# EAGLE design EMC02-Chopped (EAGLE 7.4.0)

## Sheet 1 of 4: MCU
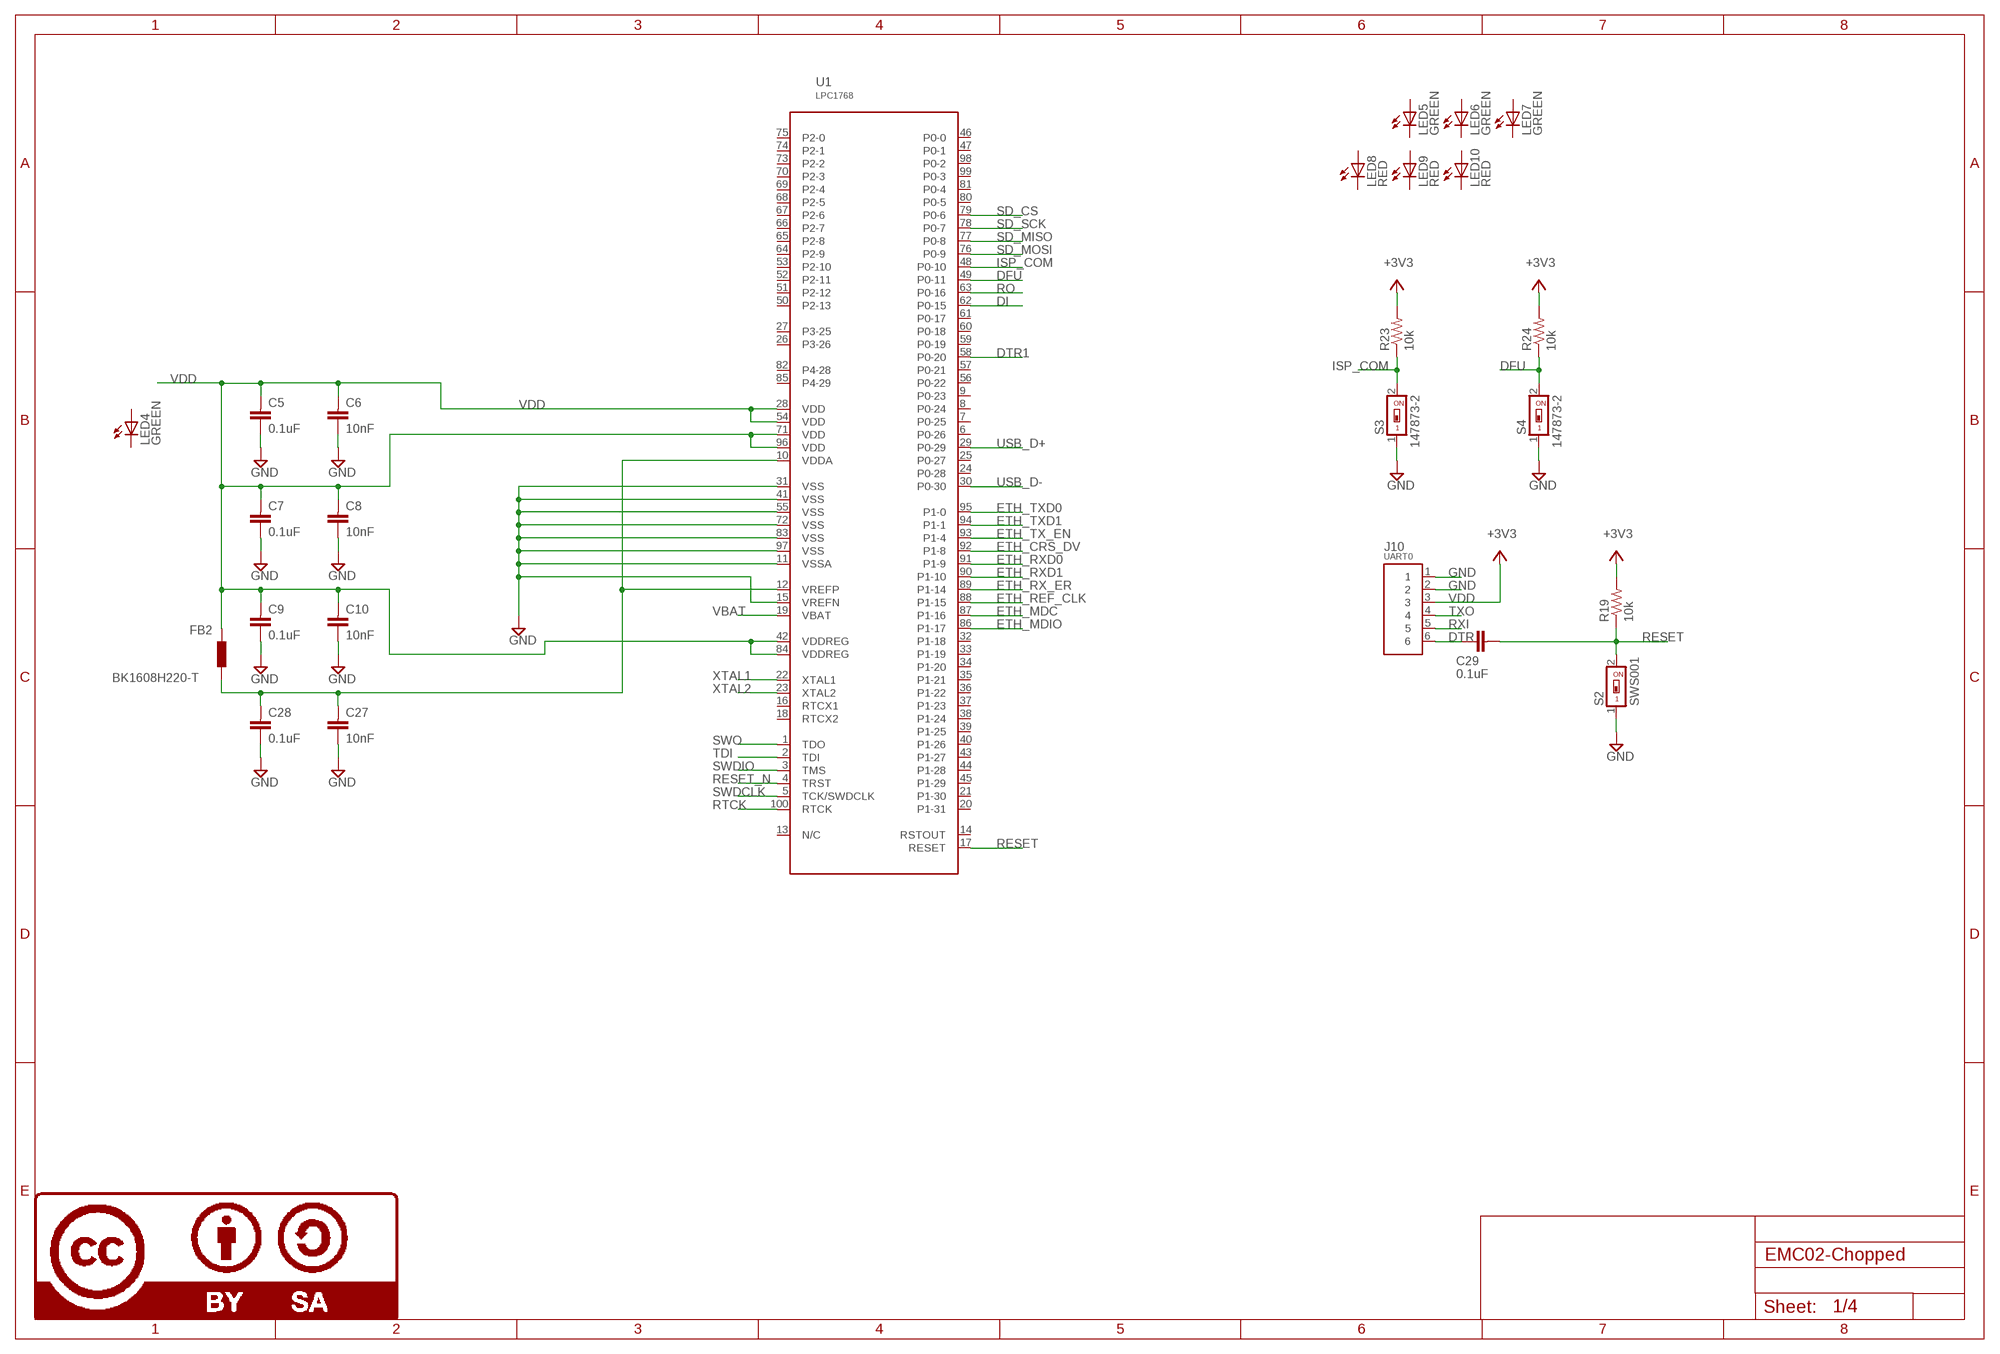
[diagram p0: schematic, sheet 1]

### Parts
C5  0.1uF  CPL-CAP-X5R-0603-0.1UF-35V  [C0603]
C6  10nF  CPL-CAP-X7R-10NF-16V  [C0603]
C7  0.1uF  CPL-CAP-X5R-0603-0.1UF-35V  [C0603]
C8  10nF  CPL-CAP-X7R-10NF-16V  [C0603]
C9  0.1uF  CPL-CAP-X5R-0603-0.1UF-35V  [C0603]
C10  10nF  CPL-CAP-X7R-10NF-16V  [C0603]
C27  10nF  CPL-CAP-X7R-10NF-16V  [C0603]
C28  0.1uF  CPL-CAP-X5R-0603-0.1UF-35V  [C0603]
C29  0.1uF  CPL-CAP-X7R-0603-0.1UF-35V  [C0603]
FB2  BK1608H220-T  BLM15HBK1608H220-T0603  [F0603]
J10  UART0  CPL-CON-HEADER-0.1IN-6P-M  [CON-HDR-6POS-MALE]
LED4  GREEN  CPL-LED-0603-GREEN  [LED0603]
LED5  GREEN  CPL-LED-0603-GREEN  [LED0603]
LED6  GREEN  CPL-LED-0603-GREEN  [LED0603]
LED7  GREEN  CPL-LED-0603-GREEN  [LED0603]
LED8  RED  CPL-LED-0603-RED  [LED0603]
LED9  RED  CPL-LED-0603-RED  [LED0603]
LED10  RED  CPL-LED-0603-RED  [LED0603]
LOGO8  LOGO-CC-BY-SALARGE  [LOGO-CC-BY-SA]
R19  10k  CPL-RES-0603-10K-0.1W  [R0603]
R23  10k  CPL-RES-0603-10K-0.1W  [R0603]
R24  10k  CPL-RES-0603-10K-0.1W  [R0603]
S2  SWS001  [SMS-001]
S3  147873-2  CPL-SW-MOM-0603  [0603]
S4  147873-2  CPL-SW-MOM-0603  [0603]
U1  LPC1768  LPC1768LQFP-100  [LQFP-100]

### Nets
+3V3: J10.3 R19.2 R23.2 R24.2 ; also sheet 2
DFU: R24.1 S4.2 U1.49(P0-11)
DI: U1.62(P0-15) ; also sheet 2
DTR: C29.1 J10.6
DTR1: U1.58(P0-20) ; also sheet 2
ETH_CRS_DV: U1.92(P1-8) ; also sheet 2
ETH_MDC: U1.87(P1-16) ; also sheet 2
ETH_MDIO: U1.86(P1-17) ; also sheet 2
ETH_REF_CLK: U1.88(P1-15) ; also sheet 2
ETH_RX_ER: U1.89(P1-14) ; also sheet 2
ETH_RXD0: U1.91(P1-9) ; also sheet 2
ETH_RXD1: U1.90(P1-10) ; also sheet 2
ETH_TX_EN: U1.93(P1-4) ; also sheet 2
ETH_TXD0: U1.95(P1-0) ; also sheet 2
ETH_TXD1: U1.94(P1-1) ; also sheet 2
GND [power]: C5.1 C6.1 C7.1 C8.1 C9.1 C10.1 C28.1 J10.1 J10.2 S2.1 S3.1 S4.1 U1.11(VSSA) U1.15(VREFN) U1.31(VSS) U1.41(VSS) U1.55(VSS) U1.72(VSS) U1.83(VSS) U1.97(VSS) ; also sheet 2,3,4
GND1: C27.1
ISP_COM: R23.1 S3.2 U1.48(P0-10)
N$2: C27.2 C28.2 FB2.1 U1.10(VDDA) U1.12(VREFP)
RESET: C29.2 R19.1 S2.2 U1.17(RESET)
RESET_N: U1.4(TRST) ; also sheet 2
RO: U1.63(P0-16) ; also sheet 2
RTCK: U1.100(RTCK) ; also sheet 2
RXI: J10.5
SD_CS: U1.79(P0-6) ; also sheet 2
SD_MISO: U1.77(P0-8) ; also sheet 2
SD_MOSI: U1.76(P0-9) ; also sheet 2
SD_SCK: U1.78(P0-7) ; also sheet 2
SWDCLK: U1.5(TCK/SWDCLK) ; also sheet 2
SWDIO: U1.3(TMS) ; also sheet 2
SWO: U1.1(TDO) ; also sheet 2
TDI: U1.2(TDI) ; also sheet 2
TXO: J10.4
USB_D+: U1.29(P0-29) ; also sheet 2
USB_D-: U1.30(P0-30) ; also sheet 2
VBAT: U1.19(VBAT)
VDD: C5.2 C6.2 C7.2 C8.2 C9.2 C10.2 FB2.2 U1.28(VDD) U1.42(VDDREG) U1.54(VDD) U1.71(VDD) U1.84(VDDREG) U1.96(VDD)
XTAL1: U1.22(XTAL1) ; also sheet 2
XTAL2: U1.23(XTAL2) ; also sheet 2
Unconnected: LED4.A LED4.C LED5.A LED5.C LED6.A LED6.C LED7.A LED7.C LED8.A LED8.C LED9.A LED9.C LED10.A LED10.C U1.6(P0-26) U1.7(P0-25) U1.8(P0-24) U1.9(P0-23) U1.13(N/C) U1.14(RSTOUT) U1.16(RTCX1) U1.18(RTCX2) U1.20(P1-31) U1.21(P1-30) U1.24(P0-28) U1.25(P0-27) U1.26(P3-26) U1.27(P3-25) U1.32(P1-18) U1.33(P1-19) U1.34(P1-20) U1.35(P1-21) U1.36(P1-22) U1.37(P1-23) U1.38(P1-24) U1.39(P1-25) U1.40(P1-26) U1.43(P1-27) U1.44(P1-28) U1.45(P1-29) U1.46(P0-0) U1.47(P0-1) U1.50(P2-13) U1.51(P2-12) U1.52(P2-11) U1.53(P2-10) U1.56(P0-22) U1.57(P0-21) U1.59(P0-19) U1.60(P0-18) U1.61(P0-17) U1.64(P2-9) U1.65(P2-8) U1.66(P2-7) U1.67(P2-6) U1.68(P2-5) U1.69(P2-4) U1.70(P2-3) U1.73(P2-2) U1.74(P2-1) U1.75(P2-0) U1.80(P0-5) U1.81(P0-4) U1.82(P4-28) U1.85(P4-29) U1.98(P0-2) U1.99(P0-3)

### Notes on the sheet
- VDD

## Sheet 2 of 4: Peripherals
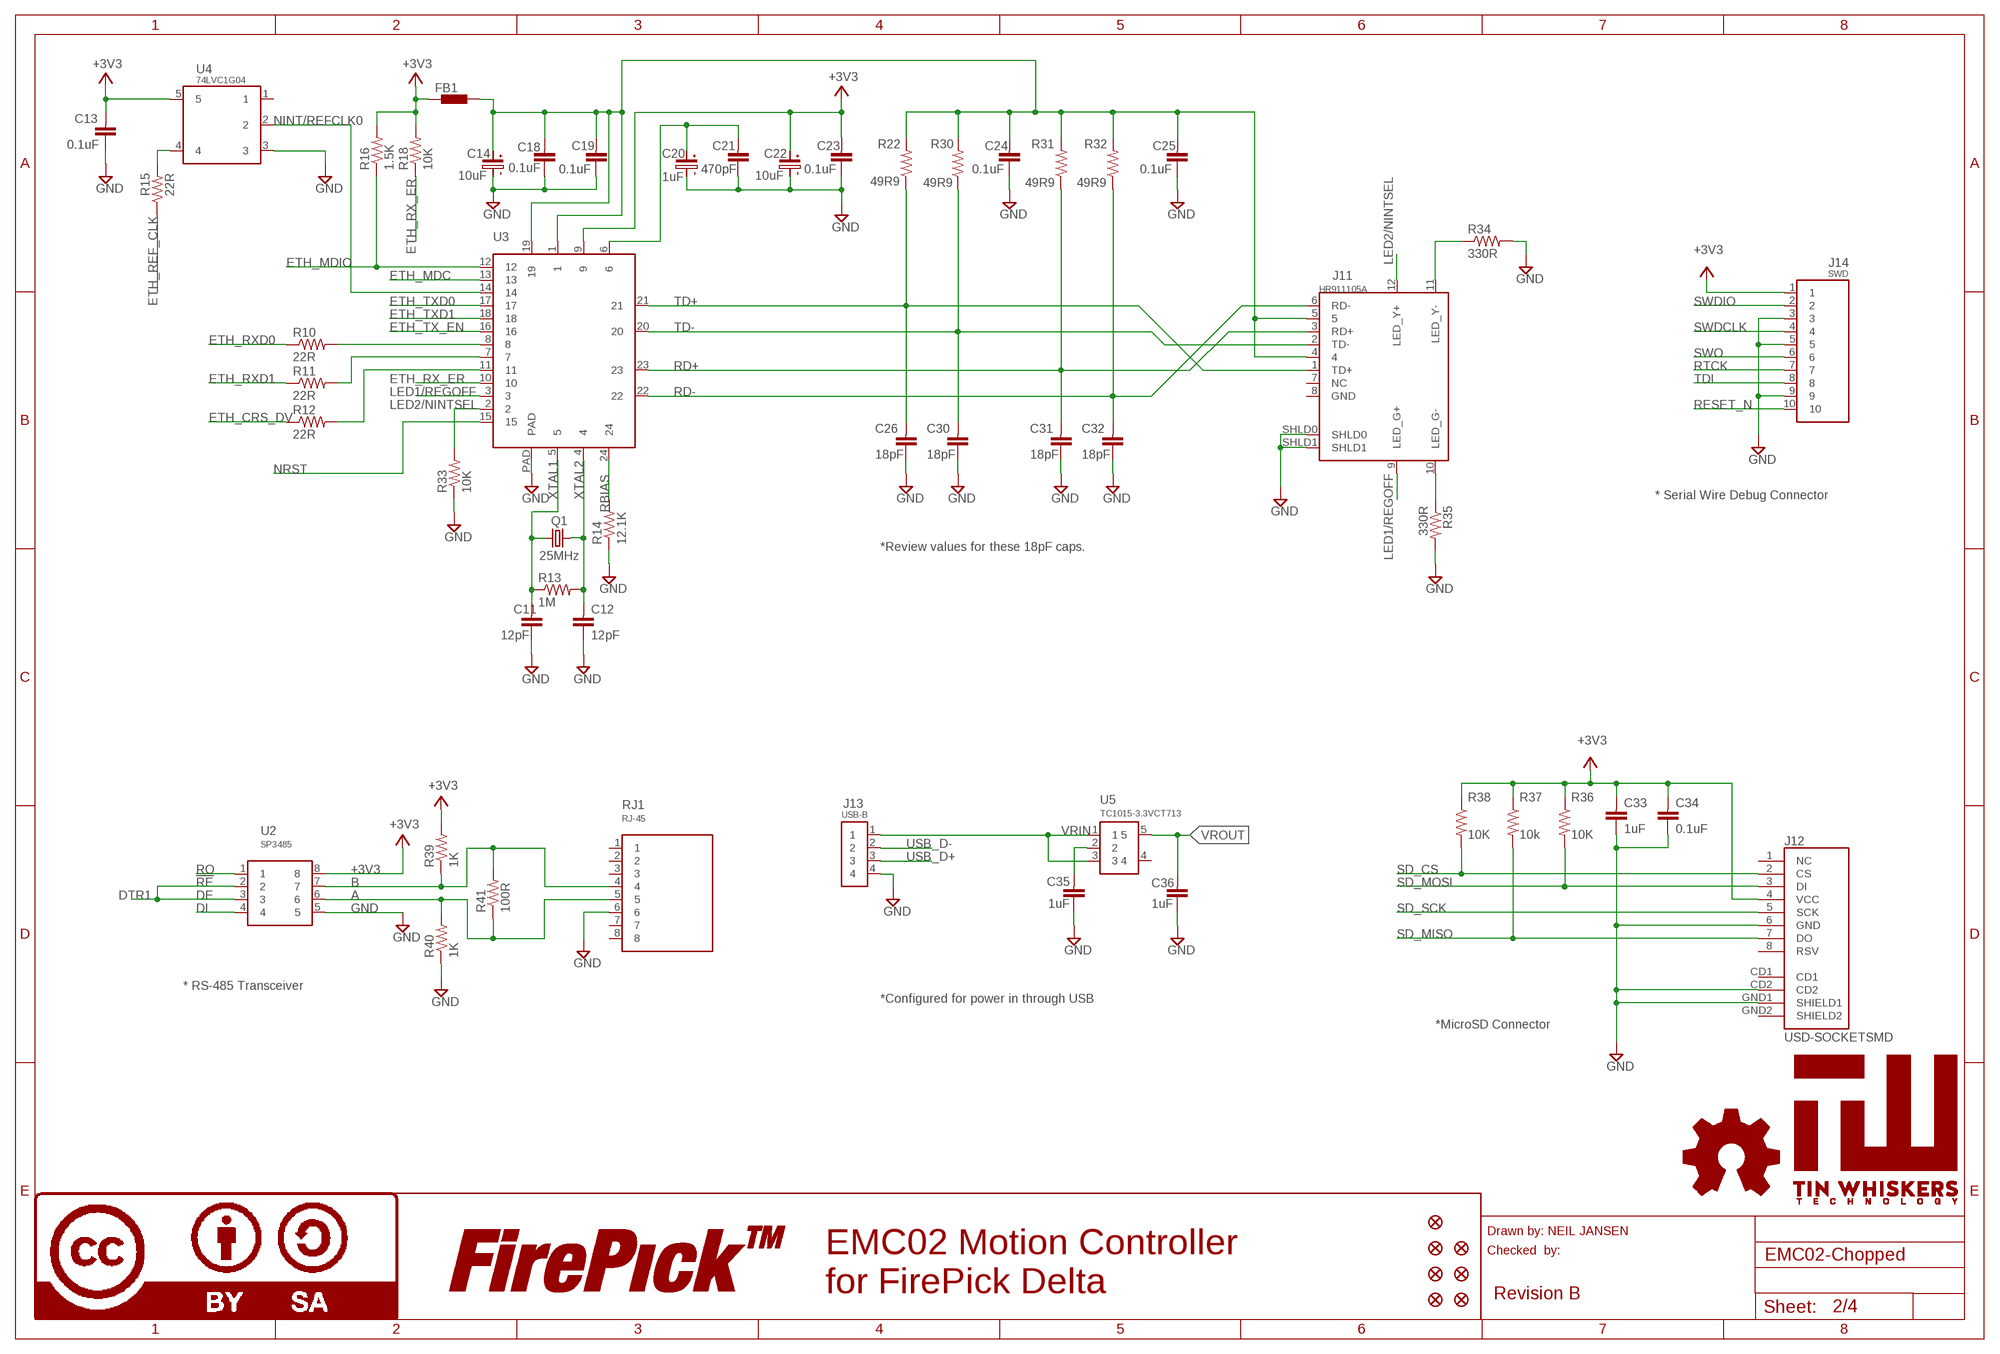
[diagram p1: schematic, sheet 2]

### Parts
C11  12pF  CPL-CAP-C0G-0603-12PF-50V  [C0603]
C12  12pF  CPL-CAP-C0G-0603-12PF-50V  [C0603]
C13  0.1uF  CPL-CAP-X5R-0603-0.1UF-35V  [C0603]
C14  10uF  CPL-CAP-ALU-RAD-10UF-50V  [C-RAD-6.3MM]
C18  0.1uF  CPL-CAP-X7R-0603-0.1UF-35V  [C0603]
C19  0.1uF  CPL-CAP-X7R-0603-0.1UF-35V  [C0603]
C20  1uF  CPL-CAP-ALU-SMD-1UF-50V  [C-SMD-4MM]
C21  470pF  CPL-CAP-X7R-0603-470PF-100V  [C0603]
C22  10uF  CPL-CAP-ALU-RAD-10UF-50V  [C-RAD-6.3MM]
C23  0.1uF  CPL-CAP-X7R-0603-0.1UF-35V  [C0603]
C24  0.1uF  CPL-CAP-X7R-0603-0.1UF-35V  [C0603]
C25  0.1uF  CPL-CAP-X7R-0603-0.1UF-35V  [C0603]
C26  18pF  CPL-CAP-C0G-0603-18PF-50V  [C0603]
C30  18pF  CPL-CAP-C0G-0603-18PF-50V  [C0603]
C31  18pF  CPL-CAP-C0G-0603-18PF-50V  [C0603]
C32  18pF  CPL-CAP-C0G-0603-18PF-50V  [C0603]
C33  1uF  CPL-CAP-X5R-0603-1UF-50V  [C0603]
C34  0.1uF  CPL-CAP-X5R-0603-0.1UF-35V  [C0603]
C35  1uF  CPL-CAP-X5R-0603-1UF-50V  [C0603]
C36  1uF  CPL-CAP-X5R-0603-1UF-50V  [C0603]
FB1  BLM15HBK1608H220-T0603  [F0603]
FID1  FIDUCIAL  [FIDUCIAL]
FID2  FIDUCIAL  [FIDUCIAL]
FID3  FIDUCIAL  [FIDUCIAL]
FID4  FIDUCIAL  [FIDUCIAL]
FID5  FIDUCIAL  [FIDUCIAL]
FID6  FIDUCIAL  [FIDUCIAL]
FID7  FIDUCIAL  [FIDUCIAL]
J11  HR911105A  CPL-ETH-MACJACK-LED-SHLD  [MAGJACK(HR911105A)]
J12  USD-SOCKETSMD  [MICRO-SD-SOCKET-PP]
J13  USB-B  CPL-CON-USB-B  [USB-B(THRU)]
J14  SWD  CPL-CON-HEADER-0.05IN-10P-M  [FTSH-105-01-XXX-DV-K]
LOGO4  LOGO-FIREPICKLARGE  [LOGO-FIREPICK]
LOGO5  LOGO-OSHWMEDIUM  [LOGO-OSHW-MEDIUM]
LOGO6  LOGO-CC-BY-SALARGE  [LOGO-CC-BY-SA]
Q1  25MHz  CPL-OSC-CRY-25MHZ-18PF  [HC-49/U-S]
R10  22R  CPL-RES-0603-22R-0.1W  [R0603]
R11  22R  CPL-RES-0603-22R-0.1W  [R0603]
R12  22R  CPL-RES-0603-22R-0.1W  [R0603]
R13  1M  CPL-RES-0603-1M-0.1W  [R0603]
R14  12.1K  CPL-RES-0603-12.1K-0.1W  [R0603]
R15  22R  CPL-RES-0603-22R-0.1W  [R0603]
R16  1.5K  CPL-RES-0603-1.5K-50V  [R0603]
R18  10K  CPL-RES-0603-10K-0.1W  [R0603]
R22  49R9  CPL-RES-0603-49.9-0.1W  [R0603]
R30  49R9  CPL-RES-0603-49.9-0.1W  [R0603]
R31  49R9  CPL-RES-0603-49.9-0.1W  [R0603]
R32  49R9  CPL-RES-0603-49.9-0.1W  [R0603]
R33  10K  CPL-RES-0603-10K-0.1W  [R0603]
R34  330R  CPL-RES-0603-330-0.1W  [R0603]
R35  330R  CPL-RES-0603-330-0.1W  [R0603]
R36  10K  CPL-RES-0603-10K-0.1W  [R0603]
R37  10k  CPL-RES-0603-10K-0.1W  [R0603]
R38  10K  CPL-RES-0603-10K-0.1W  [R0603]
R39  1K  CPL-RES-0603-1K-0.1W  [R0603]
R40  1K  CPL-RES-0603-1K-0.1W  [R0603]
R41  100R  CPL-RES-0603-100-0.1W  [R0603]
RJ1  RJ-45  CPL-CON-MOD-RJ45  [CON-RJ45]
U2  SP3485  [SOICN-8]
U3  CPL-ETH-PHY-LAN8720A  [QFN-24]
U4  74LVC1G04  CPL-INV-SOT25-5.5V-3.3V  [SOT-25]
U5  TC1015-3.3VCT713  CPL-REG-LIN-3.3V-0.1A  [SOT-23-5]
U$25  TIN-WHISKERSTSTOP  [TIN-WHISKERS-TSTOP]

### Nets
+3V3: C13.2 C22.POS C23.2 C33.2 C34.2 FB1.1 J12.4(VCC) J14.1 R16.2 R18.2 R36.1 R37.1 R38.1 R39.2 U2.8 U3.9 U4.5 ; also sheet 1
A: R40.2 R41.1 RJ1.5 U2.6
B: R39.1 R41.2 RJ1.4 U2.7
DI: U2.4 ; also sheet 1
DTR1: U2.2 U2.3 ; also sheet 1
ETH_CRS_DV: R12.1 ; also sheet 1
ETH_MDC: U3.13 ; also sheet 1
ETH_MDIO: R16.1 U3.12 ; also sheet 1
ETH_REF_CLK: R15.1 ; also sheet 1
ETH_RX_ER: R18.1 U3.10 ; also sheet 1
ETH_RXD0: R10.1 ; also sheet 1
ETH_RXD1: R11.1 ; also sheet 1
ETH_TX_EN: U3.16 ; also sheet 1
ETH_TXD0: U3.17 ; also sheet 1
ETH_TXD1: U3.18 ; also sheet 1
GND [power]: C11.1 C12.1 C13.1 C14.NEG C18.1 C19.1 C20.NEG C21.1 C22.NEG C23.1 C24.1 C25.1 C26.1 C30.1 C31.1 C32.1 C33.1 C34.1 C35.1 C36.1 J11.SHLD0 J11.SHLD1 J12.6(GND) J12.CD2 J12.GND1(SHIELD1) J13.4 J14.3 J14.5 J14.9 R14.1 R33.1 R34.2 R35.2 R40.1 RJ1.6 U2.5 U3.PAD U4.3 ; also sheet 1,3,4
LED1/REGOFF: J11.9(LED_G+) U3.3
LED2/NINTSEL: J11.12(LED_Y+) R33.2 U3.2
N$1: R10.2 U3.8
N$3: R15.2 U4.4
N$6: C14.POS C18.2 C19.2 C24.2 C25.2 FB1.2 J11.4 J11.5 R22.2 R30.2 R31.2 R32.2 U3.1 U3.19
N$7: J11.11(LED_Y-) R34.1
N$8: J11.10(LED_G-) R35.1
N$17: C35.2 U5.2
N$18: R11.2 U3.7
N$19: R12.2 U3.11
N$23: C20.POS C21.2 U3.6
NINT/REFCLK0: U3.14 U4.2
NRST: U3.15
RBIAS: R14.2 U3.24
RD+: C31.2 J11.3(RD+) R31.1 U3.23
RD-: C32.2 J11.6(RD-) R32.1 U3.22
RESET_N: J14.10 ; also sheet 1
RO: U2.1 ; also sheet 1
RTCK: J14.7 ; also sheet 1
SD_CS: J12.2(CS) R38.2 ; also sheet 1
SD_MISO: J12.7(DO) R37.2 ; also sheet 1
SD_MOSI: J12.3(DI) R36.2 ; also sheet 1
SD_SCK: J12.5(SCK) ; also sheet 1
SWDCLK: J14.4 ; also sheet 1
SWDIO: J14.2 ; also sheet 1
SWO: J14.6 ; also sheet 1
TD+: C26.2 J11.1(TD+) R22.1 U3.21
TD-: C30.2 J11.2(TD-) R30.1 U3.20
TDI: J14.8 ; also sheet 1
USB_D+: J13.3 ; also sheet 1
USB_D-: J13.2 ; also sheet 1
VRIN: J13.1 U5.1 U5.3
VROUT: C36.2 U5.5
XTAL1: C11.2 Q1.1 R13.1 U3.5 ; also sheet 1
XTAL2: C12.2 Q1.2 R13.2 U3.4 ; also sheet 1
Unconnected: J11.7(NC) J11.8(GND) J12.1(NC) J12.8(RSV) J12.CD1 J12.GND2(SHIELD2) RJ1.1 RJ1.2 RJ1.3 RJ1.7 RJ1.8 U4.1 U5.4

### Notes on the sheet
- * Serial Wire Debug Connector
- *Review values for these 18pF caps.
- !RE
- DE
- * RS-485 Transceiver
- *Configured for power in through USB
- *MicroSD Connector
- Drawn by: NEIL JANSEN
- Checked  by:
- EMC02 Motion Controller
  for FirePick Delta
- Revision B

## Sheet 3 of 4
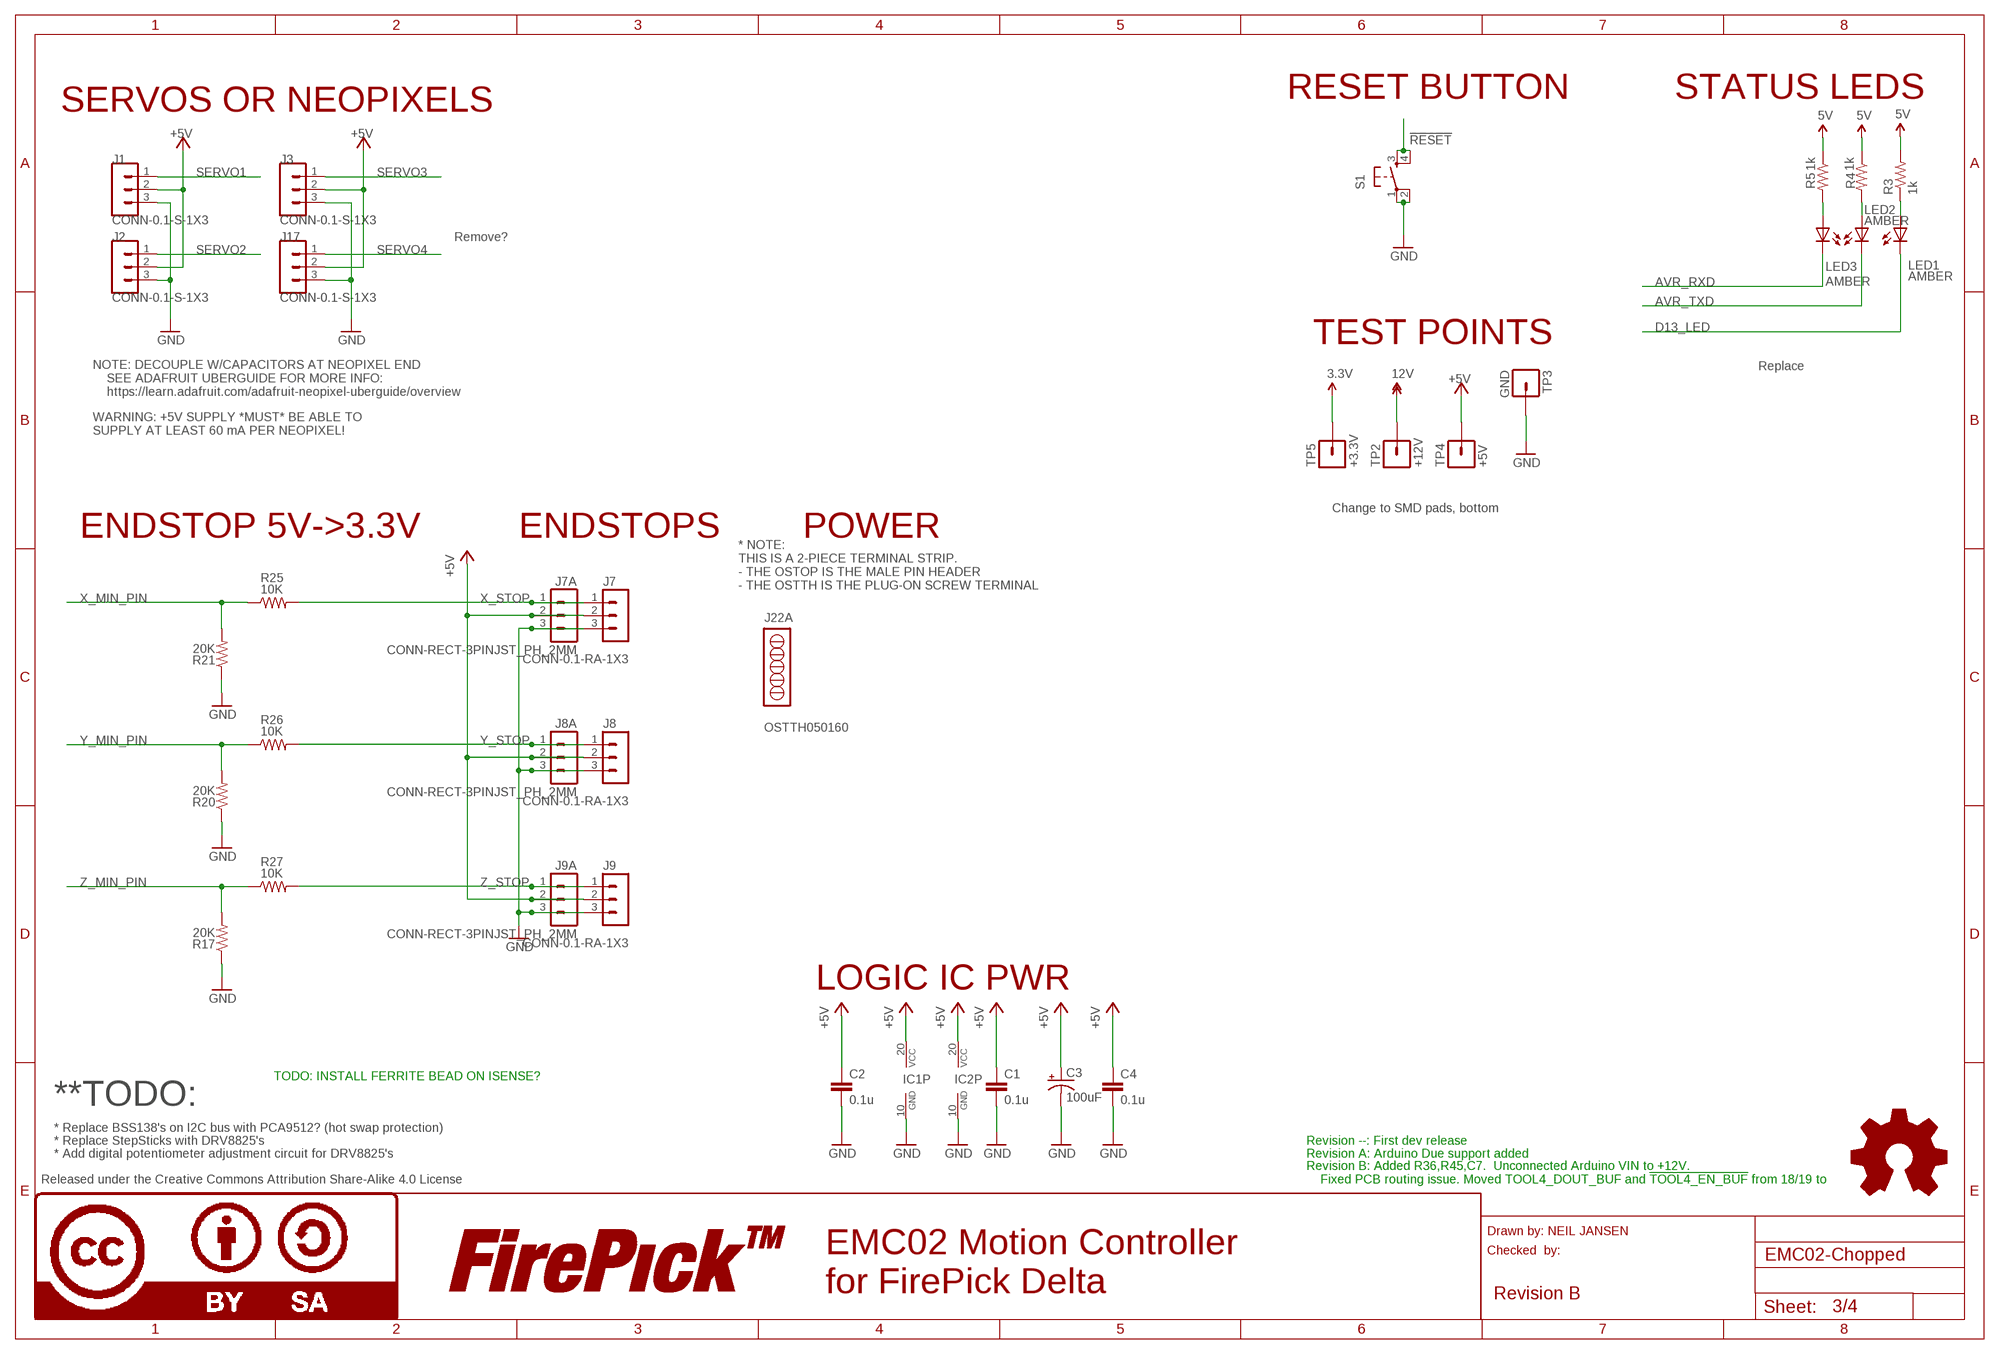
[diagram p2: schematic, sheet 3]

### Parts
C1  0.1u  CAP0805  [0805]
C2  0.1u  CAP0805  [0805]
C3  100uF  CPOL-USD  [PANASONIC_D]
C4  0.1u  CAP0805  [0805]
IC1  74ACT244DW  [SO20W]
IC2  74ACT244DW  [SO20W]
J1  CONN-0.1-S-1X3  MA03-1  [MA03-1]
J2  CONN-0.1-S-1X3  MA03-1  [MA03-1]
J3  CONN-0.1-S-1X3  MA03-1  [MA03-1]
J7  CONN-0.1-RA-1X3  MA03-1  [MA03-1]
J7A  CONN-RECT-3PINJST_PH_2MM  [CONN-JST_PH-2.0MM-3PIN-SMT-RA]
J8  CONN-0.1-RA-1X3  MA03-1  [MA03-1]
J8A  CONN-RECT-3PINJST_PH_2MM  [CONN-JST_PH-2.0MM-3PIN-SMT-RA]
J9  CONN-0.1-RA-1X3  MA03-1  [MA03-1]
J9A  CONN-RECT-3PINJST_PH_2MM  [CONN-JST_PH-2.0MM-3PIN-SMT-RA]
J17  CONN-0.1-S-1X3  MA03-1  [MA03-1]
J22A  OSTTH050160  CONN-OSTTH050160  [CONN-OSTTH050160]
LED1  AMBER  LED1206-NS  [LED-1206-NO_SILK]
LED2  AMBER  LED1206-NS  [LED-1206-NO_SILK]
LED3  AMBER  LED1206-NS  [LED-1206-NO_SILK]
LOGO1  LOGO-FIREPICKLARGE  [LOGO-FIREPICK]
LOGO2  LOGO-OSHWMEDIUM  [LOGO-OSHW-MEDIUM]
LOGO3  LOGO-CC-BY-SALARGE  [LOGO-CC-BY-SA]
R3  1k  RESISTOR0805-RES  [0805]
R4  1k  RESISTOR0805-RES  [0805]
R5  1k  RESISTOR0805-RES  [0805]
R17  20K  RESISTOR0805-RES  [0805]
R20  20K  RESISTOR0805-RES  [0805]
R21  20K  RESISTOR0805-RES  [0805]
R25  10K  RESISTOR0805-RES  [0805]
R26  10K  RESISTOR0805-RES  [0805]
R27  10K  RESISTOR0805-RES  [0805]
S1  TAC_SWITCHSMD  [TACTILE_SWITCH_SMD]
TP2  +12V  CONN-TESTPOINT  [CON-TESTPOINT]
TP3  GND  CONN-TESTPOINT  [CON-TESTPOINT]
TP4  +5V  CONN-TESTPOINT  [CON-TESTPOINT]
TP5  +3.3V  CONN-TESTPOINT  [CON-TESTPOINT]

### Nets
3.3V: TP5.1
12V: TP2.1 ; also sheet 4
!RESET: S1.3 S1.4
+5V [power]: C1.1 C2.1 C3.+ C4.1 IC1.20(P:VCC) IC2.20(P:VCC) J1.2 J2.2 J3.2 J7.2 J7A.2 J8.2 J8A.2 J9.2 J9A.2 J17.2 R3.2 R4.1 R5.1 TP4.1 ; supply symbol labelled 5V ; also sheet 4
AVR_RXD: LED3.C
AVR_TXD: LED2.C
D13_LED: LED1.C
GND [power]: C1.2 C2.2 C3.- C4.2 IC1.10(P:GND) IC2.10(P:GND) J1.3 J2.3 J3.3 J7.3 J7A.3 J8.3 J8A.3 J9.3 J9A.3 J17.3 R17.1 R20.1 R21.1 S1.1 S1.2 TP3.1 ; also sheet 1,2,4
N$4: LED1.A R3.1
N$21: LED2.A R4.2
N$22: LED3.A R5.2
SERVO1: J1.1 ; also sheet 4
SERVO2: J2.1 ; also sheet 4
SERVO3: J3.1 ; also sheet 4
SERVO4: J17.1 ; also sheet 4
X_MIN_PIN: R21.2 R25.1
X_STOP: J7.1 J7A.1 R25.2
Y_MIN_PIN: R20.2 R26.1
Y_STOP: J8.1 J8A.1 R26.2
Z_MIN_PIN: R17.2 R27.1
Z_STOP: J9.1 J9A.1 R27.2
Unconnected: IC2.1(A:G) IC2.2(A:A1) IC2.3(B:Y4) IC2.4(A:A2) IC2.5(B:Y3) IC2.6(A:A3) IC2.7(B:Y2) IC2.8(A:A4) IC2.9(B:Y1) IC2.11(B:A1) IC2.12(A:Y4) IC2.13(B:A2) IC2.14(A:Y3) IC2.15(B:A3) IC2.16(A:Y2) IC2.17(B:A4) IC2.18(A:Y1) IC2.19(B:G)

### Notes on the sheet
- RESET BUTTON | STATUS LEDS
- SERVOS OR NEOPIXELS
- Remove?
- TEST POINTS
- Replace
- NOTE: DECOUPLE W/CAPACITORS AT NEOPIXEL END
      SEE ADAFRUIT UBERGUIDE FOR MORE INFO:
      https://learn.adafruit.com/adafruit-neopixel-uberguide/overview
- WARNING: +5V SUPPLY *MUST* BE ABLE TO 
  SUPPLY AT LEAST 60 mA PER NEOPIXEL!
- Change to SMD pads, bottom
- ENDSTOP 5V->3.3V | ENDSTOPS | POWER
- * NOTE: 
  THIS IS A 2-PIECE TERMINAL STRIP.
  - THE OSTOP IS THE MALE PIN HEADER
  - THE OSTTH IS THE PLUG-ON SCREW TERMINAL
- LOGIC IC PWR
- TODO: INSTALL FERRITE BEAD ON ISENSE?
- **TODO:
- * Replace BSS138's on I2C bus with PCA9512? (hot swap protection)
- * Replace StepSticks with DRV8825's | Revision --: First dev release
- * Add digital potentiometer adjustment circuit for DRV8825's | Revision A: Arduino Due support added
- Released under the Creative Commons Attribution Share-Alike 4.0 License
- Revision B: Added R36,R45,C7.  Unconnected Arduino VIN to +12V.  
      Fixed PCB routing issue. Moved TOOL4_DOUT_BUF and !TOOL4_EN_BUF! from 18/19 to
- Drawn by: NEIL JANSEN
- Checked  by:
- EMC02 Motion Controller
  for FirePick Delta
- Revision B

## Sheet 4 of 4: Mot/E-Stop
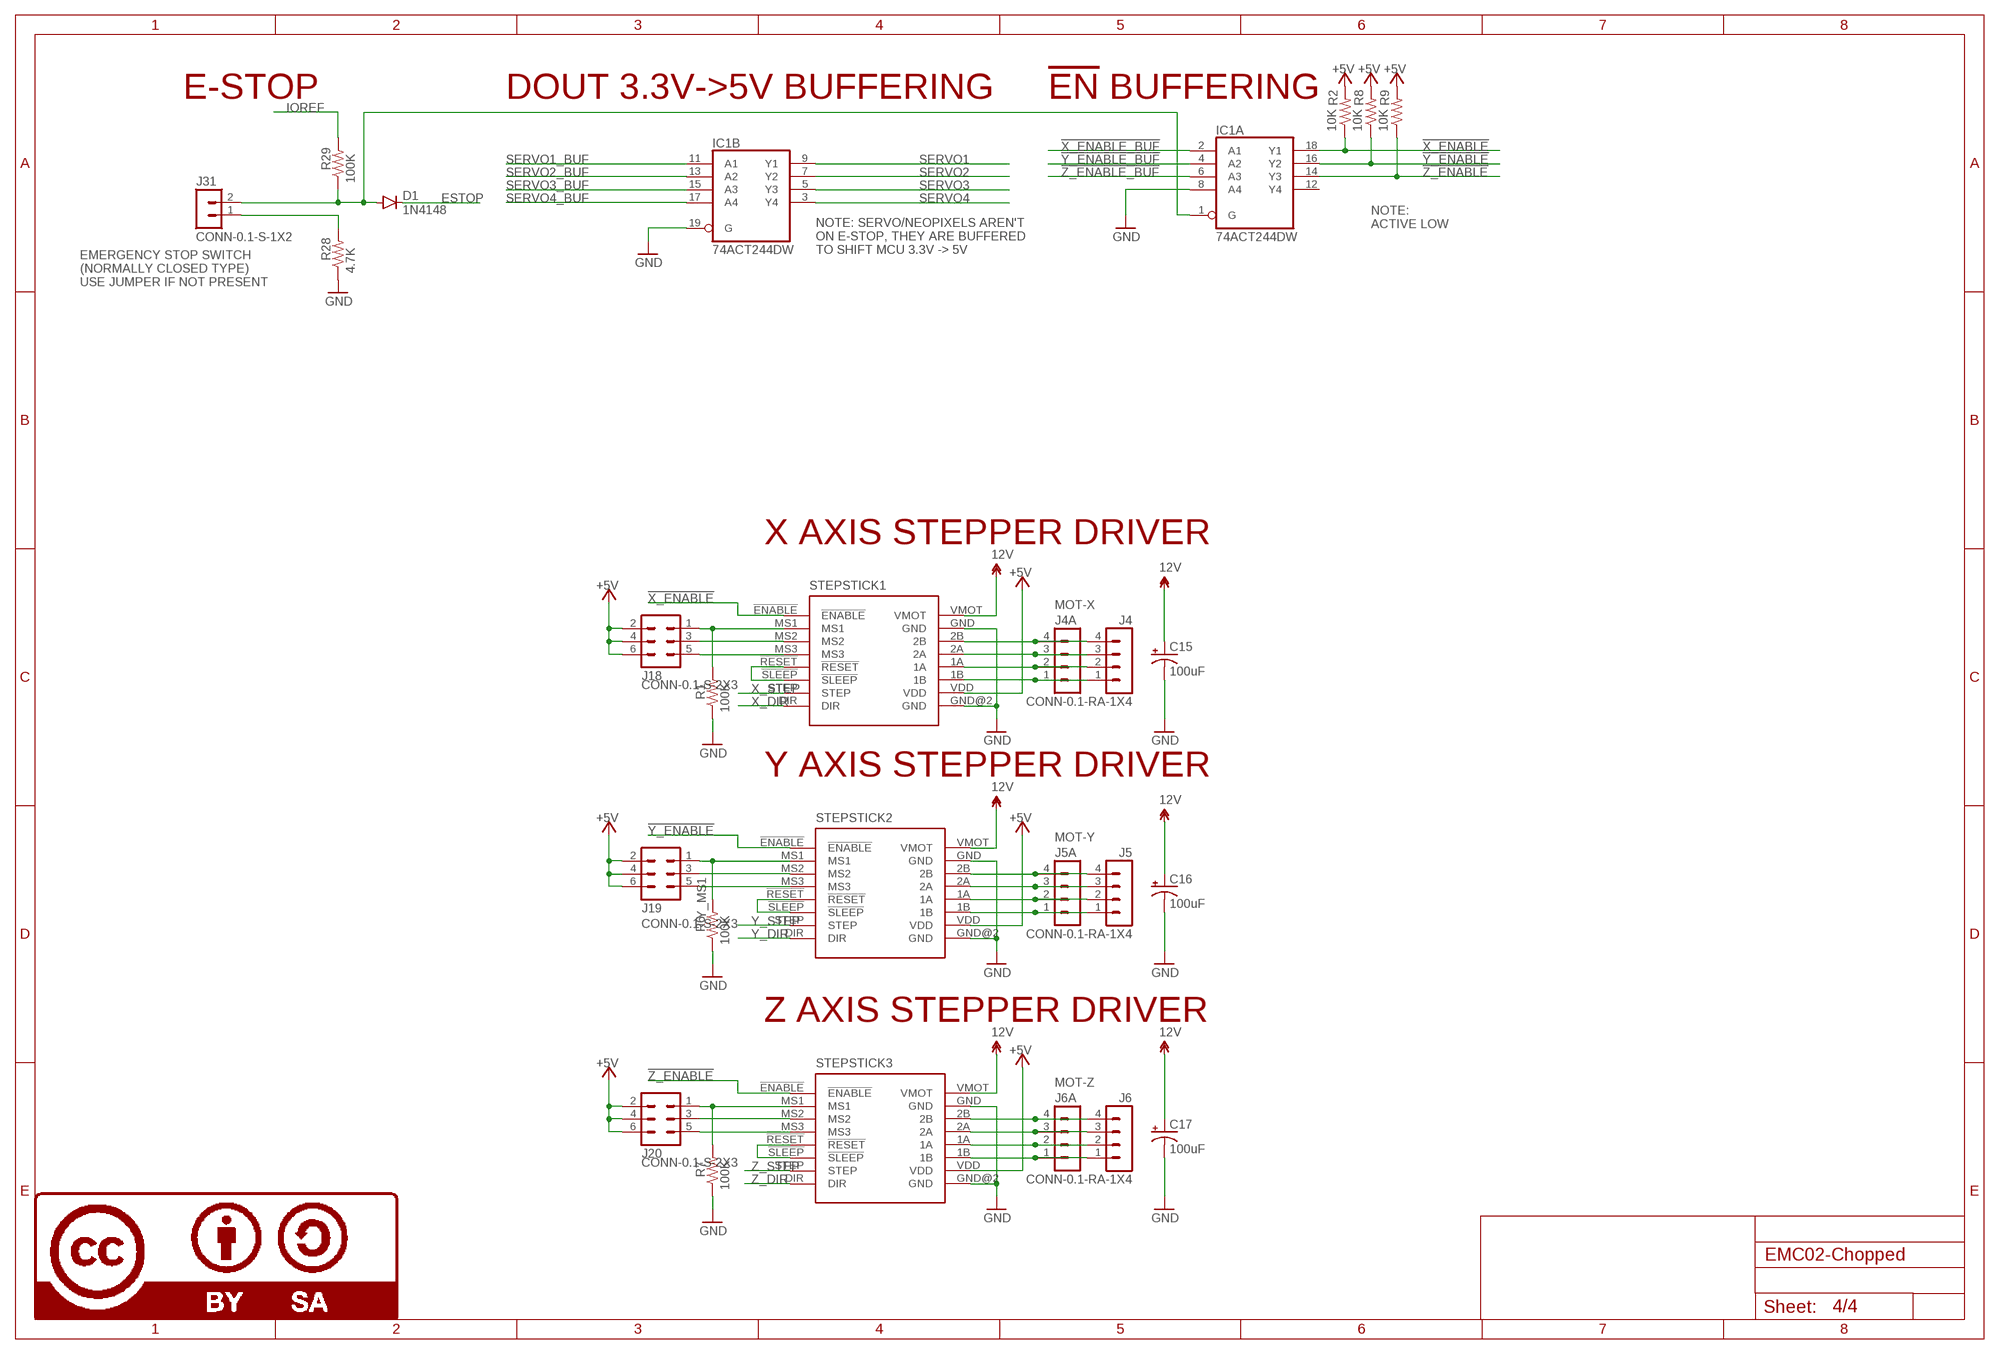
[diagram p3: schematic, sheet 4]

### Parts
C15  100uF  CPOL-USD  [PANASONIC_D]
C16  100uF  CPOL-USD  [PANASONIC_D]
C17  100uF  CPOL-USD  [PANASONIC_D]
D1  1N4148  DIODESOD123  [SOD-123]
J4  CONN-0.1-RA-1X4  MA04-1  [MA04-1]
J4A  MOT-X  CONN-RECT-4PINJST-PH-2MM  [CONN-JST-PH_2.0MM_4PIN-SMT-RA]
J5  CONN-0.1-RA-1X4  MA04-1  [MA04-1]
J5A  MOT-Y  CONN-RECT-4PINJST-PH-2MM  [CONN-JST-PH_2.0MM_4PIN-SMT-RA]
J6  CONN-0.1-RA-1X4  MA04-1  [MA04-1]
J6A  MOT-Z  CONN-RECT-4PINJST-PH-2MM  [CONN-JST-PH_2.0MM_4PIN-SMT-RA]
J18  CONN-0.1-S-2X3  MA03-2  [MA03-2]
J19  CONN-0.1-S-2X3  MA03-2  [MA03-2]
J20  CONN-0.1-S-2X3  MA03-2  [MA03-2]
J31  CONN-0.1-S-1X2  MA02-1  [MA02-1]
LOGO7  LOGO-CC-BY-SALARGE  [LOGO-CC-BY-SA]
R1  100K  RESISTOR0805-RES  [0805]
R2  10K  RESISTOR0805-RES  [0805]
R6  100K  RESISTOR0805-RES  [0805]
R7  100K  RESISTOR0805-RES  [0805]
R8  10K  RESISTOR0805-RES  [0805]
R9  10K  RESISTOR0805-RES  [0805]
R28  4.7K  RESISTOR0805-RES  [0805]
R29  100K  RESISTOR0805-RES  [0805]
STEPSTICK1  STEPSTICK  [STEPSTICK]
STEPSTICK2  STEPSTICK  [STEPSTICK]
STEPSTICK3  STEPSTICK  [STEPSTICK]

### Nets
12V: C15.+ C16.+ C17.+ STEPSTICK1.VMOT STEPSTICK2.VMOT STEPSTICK3.VMOT ; also sheet 3
!X_ENABLE: IC1.18(A:Y1) R2.1 STEPSTICK1.!ENABLE!
!X_ENABLE_BUF: IC1.2(A:A1)
!Y_ENABLE: IC1.16(A:Y2) R8.1 STEPSTICK2.!ENABLE!
!Y_ENABLE_BUF: IC1.4(A:A2)
!Z_ENABLE: IC1.14(A:Y3) R9.1 STEPSTICK3.!ENABLE!
!Z_ENABLE_BUF: IC1.6(A:A3)
+5V [power]: J18.2 J18.4 J18.6 J19.2 J19.4 J19.6 J20.2 J20.4 J20.6 R2.2 R8.2 R9.2 STEPSTICK1.VDD STEPSTICK2.VDD STEPSTICK3.VDD ; also sheet 3
ESTOP: D1.C
ESTOP_OE: D1.A IC1.1(A:G) J31.2 R29.1
GND [power]: C15.- C16.- C17.- IC1.8(A:A4) IC1.19(B:G) R1.1 R6.1 R7.1 R28.1 STEPSTICK1.GND STEPSTICK1.GND@2(GND) STEPSTICK2.GND STEPSTICK2.GND@2(GND) STEPSTICK3.GND STEPSTICK3.GND@2(GND) ; also sheet 1,2,3
IOREF: R29.2
N$5: J31.1 R28.2
N$11: STEPSTICK1.!RESET! STEPSTICK1.!SLEEP!
N$16: STEPSTICK2.!RESET! STEPSTICK2.!SLEEP!
N$24: STEPSTICK3.!RESET! STEPSTICK3.!SLEEP!
SERVO1: IC1.9(B:Y1) ; also sheet 3
SERVO1_BUF: IC1.11(B:A1)
SERVO2: IC1.7(B:Y2) ; also sheet 3
SERVO2_BUF: IC1.13(B:A2)
SERVO3: IC1.5(B:Y3) ; also sheet 3
SERVO3_BUF: IC1.15(B:A3)
SERVO4: IC1.3(B:Y4) ; also sheet 3
SERVO4_BUF: IC1.17(B:A4)
X1A: J4.2 J4A.2 STEPSTICK1.1A
X1B: J4.1 J4A.1 STEPSTICK1.1B
X2A: J4.3 J4A.3 STEPSTICK1.2A
X2B: J4.4 J4A.4 STEPSTICK1.2B
X_DIR: STEPSTICK1.DIR
X_MS1: J18.1 R1.2 STEPSTICK1.MS1
X_MS2: J18.3 STEPSTICK1.MS2
X_MS3: J18.5 STEPSTICK1.MS3
X_STEP: STEPSTICK1.STEP
Y1A: J5.2 J5A.2 STEPSTICK2.1A
Y1B: J5.1 J5A.1 STEPSTICK2.1B
Y2A: J5.3 J5A.3 STEPSTICK2.2A
Y2B: J5.4 J5A.4 STEPSTICK2.2B
Y_DIR: STEPSTICK2.DIR
Y_MS1: J19.1 R6.2 STEPSTICK2.MS1
Y_MS2: J19.3 STEPSTICK2.MS2
Y_MS3: J19.5 STEPSTICK2.MS3
Y_STEP: STEPSTICK2.STEP
Z1A: J6.2 J6A.2 STEPSTICK3.1A
Z1B: J6.1 J6A.1 STEPSTICK3.1B
Z2A: J6.3 J6A.3 STEPSTICK3.2A
Z2B: J6.4 J6A.4 STEPSTICK3.2B
Z_DIR: STEPSTICK3.DIR
Z_MS1 [power]: J20.1 R7.2 STEPSTICK3.MS1
Z_MS2: J20.3 STEPSTICK3.MS2
Z_MS3: J20.5 STEPSTICK3.MS3
Z_STEP: STEPSTICK3.STEP
Unconnected: IC1.12(A:Y4)

### Notes on the sheet
- E-STOP | DOUT 3.3V->5V BUFFERING | !EN! BUFFERING
- NOTE:
  ACTIVE LOW
- NOTE: SERVO/NEOPIXELS AREN'T 
  ON E-STOP, THEY ARE BUFFERED
  TO SHIFT MCU 3.3V -> 5V
- EMERGENCY STOP SWITCH
  (NORMALLY CLOSED TYPE)
  USE JUMPER IF NOT PRESENT
- X AXIS STEPPER DRIVER
- Y AXIS STEPPER DRIVER
- Z AXIS STEPPER DRIVER

## Library data of the parts
C1 C2 C4 = SparkFun-Capacitors:CAP: Capacitor Standard 0603 ceramic capacitor, and 0.1" leaded capacitor.; PARTNO: CC0805ZRY5V9BB104
C3 C15-C17 = rcl:CPOL-US: POLARIZED CAPACITOR, American symbol; PARTNO: 25TXV100M6.3X8
C5 C7 C9 C13 C28 C34 = TinWhiskers:CPL-CAP-X5R-0603-0.1UF-35V: Capacitor: 0.1uF, 35V, 10%, X5R; Package: 0603; Datasheet: http://www.yuden.co.jp/productdata/catalog/en/mlcc01_hq_e.pdf
C6 C8 C10 C27 = TinWhiskers:CPL-CAP-X7R-10NF-16V: Capacitor: 10nF(0.01uF), 16V, 5%; Package: 0603; Datasheet: http://www.mouser.com/ds/2/396/mlcc_all_e-541559.pdf
C11 C12 = TinWhiskers:CPL-CAP-C0G-0603-12PF-50V: Capacitor: 12pF, 50V, 5%; Package: 0603; Datasheet: http://download.siliconexpert.com/pdfs/2011/4/6/10/1/57/701/samelm_/manual/cl10c120jb8nnnc.pdf
C14 C22 = TinWhiskers:CPL-CAP-ALU-RAD-10UF-50V
C18 C19 C23-C25 C29 = TinWhiskers:CPL-CAP-X7R-0603-0.1UF-35V: Capacitor: 0.1uF, 35V, 10%, X7R; Package: 0603; Datasheet: http://www.yuden.co.jp/productdata/catalog/en/mlcc01_hq_e.pdf
C20 = TinWhiskers:CPL-CAP-ALU-SMD-1UF-50V: Capacitor, Al-Electrolytic: 1uF, 50v, 20%; Package: 4mm Barrel (SMD); Datasheet: http://www.mouser.com/ds/2/212/KEM_A4001_EDK-535350.pdf
C21 = TinWhiskers:CPL-CAP-X7R-0603-470PF-100V: Capacitor: 470pF, 100V, 5%; Package: 0603 Datasheet: http://www.mouser.com/ds/2/427/vjw1bcbascomseries-223529.pdf
C26 C30-C32 = TinWhiskers:CPL-CAP-C0G-0603-18PF-50V: Capacitor: 18pF, 50V, 5%; Package: 0603; Datasheet: http://www.mouser.com/ds/2/427/vjw1bcbascomseries-223529.pdf
C33 C35 C36 = TinWhiskers:CPL-CAP-X5R-0603-1UF-50V: Capacitor: 0.1uF, 50V, 10%; Package: 0603; Datasheet: http://www.mouser.com/ds/2/396/mlcc_all_e-541559.pdf
D1 = SparkFun-DiscreteSemi:DIODE: Diode These are standard reverse protection diodes and small signal diodes. SMA package can handle up to about 1A. SOD-323 can handle about 200mA. What the SOD-323 package when ordering, there are some mfgs out there that are 5-pin packages.; PARTNO: 1N4148W-7-F
FB1 FB2 = TinWhiskers:BLM15H: EMIFIL (R) Chip Ferrite Bead for GHz Noise Source: http://www.murata.com/ Ferrite Bead BLM15H.pdf
FID1-FID7 = FirePick:FIDUCIAL; BOM: EXCLUDE
IC1 IC2 = 74xx-eu:74*244: Octal BUFFER and LINE DRIVER, 3-state; PARTNO: 74ACT244SCX
J1-J3 J17 = !con-lstb:MA03-1: PIN HEADER; PARTNO: CONN-0.1-S-1X3
J4-J6 = !con-lstb:MA04-1: PIN HEADER; PARTNO: CONN-0.1-RA-1X4
J4A J5A J6A = FirePick:CONN-RECT-4PIN; DNP: T
J7-J9 = !con-lstb:MA03-1: PIN HEADER; PARTNO: CONN-0.1-RA-1X3
J7A J8A J9A = FirePick:CONN-RECT-3PIN; DNP: T
J10 = TinWhiskers:CPL-CON-HEADER-0.1IN-6P-M: Connector: Header, 0.1"-Pitch, 6-Pos, Pins (Male)
J11 = TinWhiskers:CPL-ETH-MACJACK-LED-SHLD: Connector: Ethernet, MagJack, RJ-45, Status LEDs+Shield; Datasheet: http://www.kosmodrom.com.ua/pdf/HR911105A.pdf
J12 = TinWhiskers:USD-SOCKET: microSD Socket Push-push type uSD socket. Schematic element and footprint production proven. Spark Fun Electronics SKU : PRT-00127. tDoc lines correctly indicate media card edge positions when inserting (unlocked, locked, depressed).
J13 = TinWhiskers:CPL-CON-USB-B: Connector: USB, B-type
J14 = TinWhiskers:CPL-CON-HEADER-0.05IN-10P-M
J18-J20 = !con-lstb:MA03-2: PIN HEADER; PARTNO: CONN-0.1-S-2X3
J22A = FirePick:CONN-OSTTH050160; PARTNO: OSTTH050160
J31 = !con-lstb:MA02-1; PARTNO: CONN-0.1-S-1X2
LED1-LED3 = SparkFun-LED:LED: LEDs Standard schematic elements and footprints for 5mm, 3mm, 1206, and 0603 sized LEDs. 5mm - Spark Fun Electronics SKU : COM-00529 (and others); PARTNO: LTST-C150AKT
LED4-LED7 = TinWhiskers:CPL-LED-0603-GREEN: LED: Green; Package: 0603
LED8-LED10 = TinWhiskers:CPL-LED-0603-RED: LED: Red; Package: 0603
LOGO1 LOGO4 = FirePick:LOGO-FIREPICK; BOM: EXCLUDE
LOGO2 LOGO5 = FirePick:LOGO-OSHW; BOM: EXCLUDE
LOGO3 LOGO6-LOGO8 = FirePick:LOGO-CC-BY-SA; BOM: EXCLUDE
Q1 = TinWhiskers:CPL-OSC-CRY-25MHZ-18PF: Crystal Oscillator: 25MHz, 18pF, 30PPM; Package: HC-49/U-S; Datasheet: http://www.mouser.com/ds/2/77/HCM49-5106.pdf
R1 R6 R7 R29 = SparkFun-Resistors:RESISTOR: Resistor Basic schematic elements and footprints for 0603, 1206, and PTH resistors.; PARTNO: RC0805FR-07100KL
R2 R8 R9 R25-R27 = SparkFun-Resistors:RESISTOR: Resistor Basic schematic elements and footprints for 0603, 1206, and PTH resistors.; PARTNO: RC0805FR-0710KL
R3-R5 = SparkFun-Resistors:RESISTOR: Resistor Basic schematic elements and footprints for 0603, 1206, and PTH resistors.; PARTNO: RC0805FR-071KL
R10-R12 R15 = TinWhiskers:CPL-RES-0603-22R-0.1W: Resistor, 22 Ohm, 0.1W, 10%; Package: 0603
R13 = TinWhiskers:CPL-RES-0603-1M-0.1W: Resistor: 1MOhm, 0.1W, 5%; Package: 0603; Datasheet: http://www.samsungsem.com/global/support/library/product-catalog/__icsFiles/afieldfile/2015/01/12/CHIP_RESISTOR_150112_1.pdf
R14 = TinWhiskers:CPL-RES-0603-12.1K-0.1W: Resistor: 12.1 kOhm, 0.1W, 1%; Package: 0603; Datasheet: http://www.samsungsem.com/global/support/library/product-catalog/__icsFiles/afieldfile/2015/01/12/CHIP_RESISTOR_150112_1.pdf
R16 = TinWhiskers:CPL-RES-0603-1.5K-50V: Resistor: 1.5KOhm, 0.1W, 5%; Package: 0603; Datasheet: http://www.mouser.com/ds/2/427/dcrcwe3-109170.pdf
R17 R20 R21 = SparkFun-Resistors:RESISTOR: Resistor Basic schematic elements and footprints for 0603, 1206, and PTH resistors.; PARTNO: RC0805FR-0720KL
R18 R19 R23 R24 R33 R36-R38 = TinWhiskers:CPL-RES-0603-10K-0.1W: Resistor: 10kOhm, 0.1W, 1%; Package: 0603; Datasheet: http://www.mouser.com/ds/2/315/AOA0000CE2-37512.pdf
R22 R30-R32 = TinWhiskers:CPL-RES-0603-49.9-0.1W: Resistor: 49.9Ohms, 0.1W, 1%; Package: 0603; Datasheet: http://www.mouser.com/ds/2/219/RN73H-12200.pdf
R28 = SparkFun-Resistors:RESISTOR: Resistor Basic schematic elements and footprints for 0603, 1206, and PTH resistors.; PARTNO: RC0805FR-074K7L
R34 R35 = TinWhiskers:CPL-RES-0603-330-0.1W: Resistor: 330Ohm, 0.1W, 5%; Package: 0603; Datasheet: http://www.mouser.com/ds/2/427/dcrcwe3-109170.pdf
R39 R40 = TinWhiskers:CPL-RES-0603-1K-0.1W
R41 = TinWhiskers:CPL-RES-0603-100-0.1W: Resistor: 100 Ohm, 0.1W, 1%; Package: 0603;
RJ1 = TinWhiskers:CPL-CON-MOD-RJ45: Connector: Modular Jack (RJ-45); Datasheet: http://www.farnell.com/cad/1859325.pdf
S1 = SparkFun:TAC_SWITCH: Momentary Switch Button commonly used for reset or general input. Spark Fun Electronics SKU : COM-00097; PARTNO: SWITCH TACTILE SPST-NO 0.05A 12V
S2 = smd-special:SWS001: SMD Dip Switch 1 pol.
S3 S4 = TinWhiskers:CPL-SW-MOM-0603: Switch: Push-button, Mom.; Package: 0603
STEPSTICK1-STEPSTICK3 = FirePick:STEPSTICK; PARTNO: PPPC081LFBN-RC
TP2-TP5 = FirePick:CONN-TESTPOINT; DNP: T
U1 = TinWhiskers:LPC1768: Microprocessor: ARM Cortex-M3 Mfr: NXP Semiconductors; Package: LQFP-100; Datasheet: http://www.nxp.com/documents/data_sheet/LPC1769_68_67_66_65_64_63.pdf
U2 = TinWhiskers:SP3485: Transceiver: RS-485 Chip; Package: SOICN-8; Datasheet: http://www.exar.com/common/content/document.ashx?id=639
U3 = TinWhiskers:CPL-ETH-PHY-LAN8720A: Physical Ethernet Chip; Package: QFN-24; Datasheet: http://ww1.microchip.com/downloads/en/DeviceDoc/8720a.pdf
U4 = TinWhiskers:CPL-INV-SOT25-5.5V-3.3V: Single Inverter; Package: SOT-25; Datasheet: http://www.mouser.com/ds/2/115/74LVC1G04-72218.pdf
U5 = TinWhiskers:CPL-REG-LIN-3.3V-0.1A: Voltage Regulator: Linear, Vmax=6, Vout=3.3V, Io=0.1mA; Package: SOT-23-5 Datasheet: http://www.mouser.com/ds/2/268/21335b-29125.pdf
U$25 = !tin-whiskers:TIN-WHISKERS

## Net classes
0 default: width 0.152 mm, drill 0.305 mm, clearance 0.152 mm

## Board
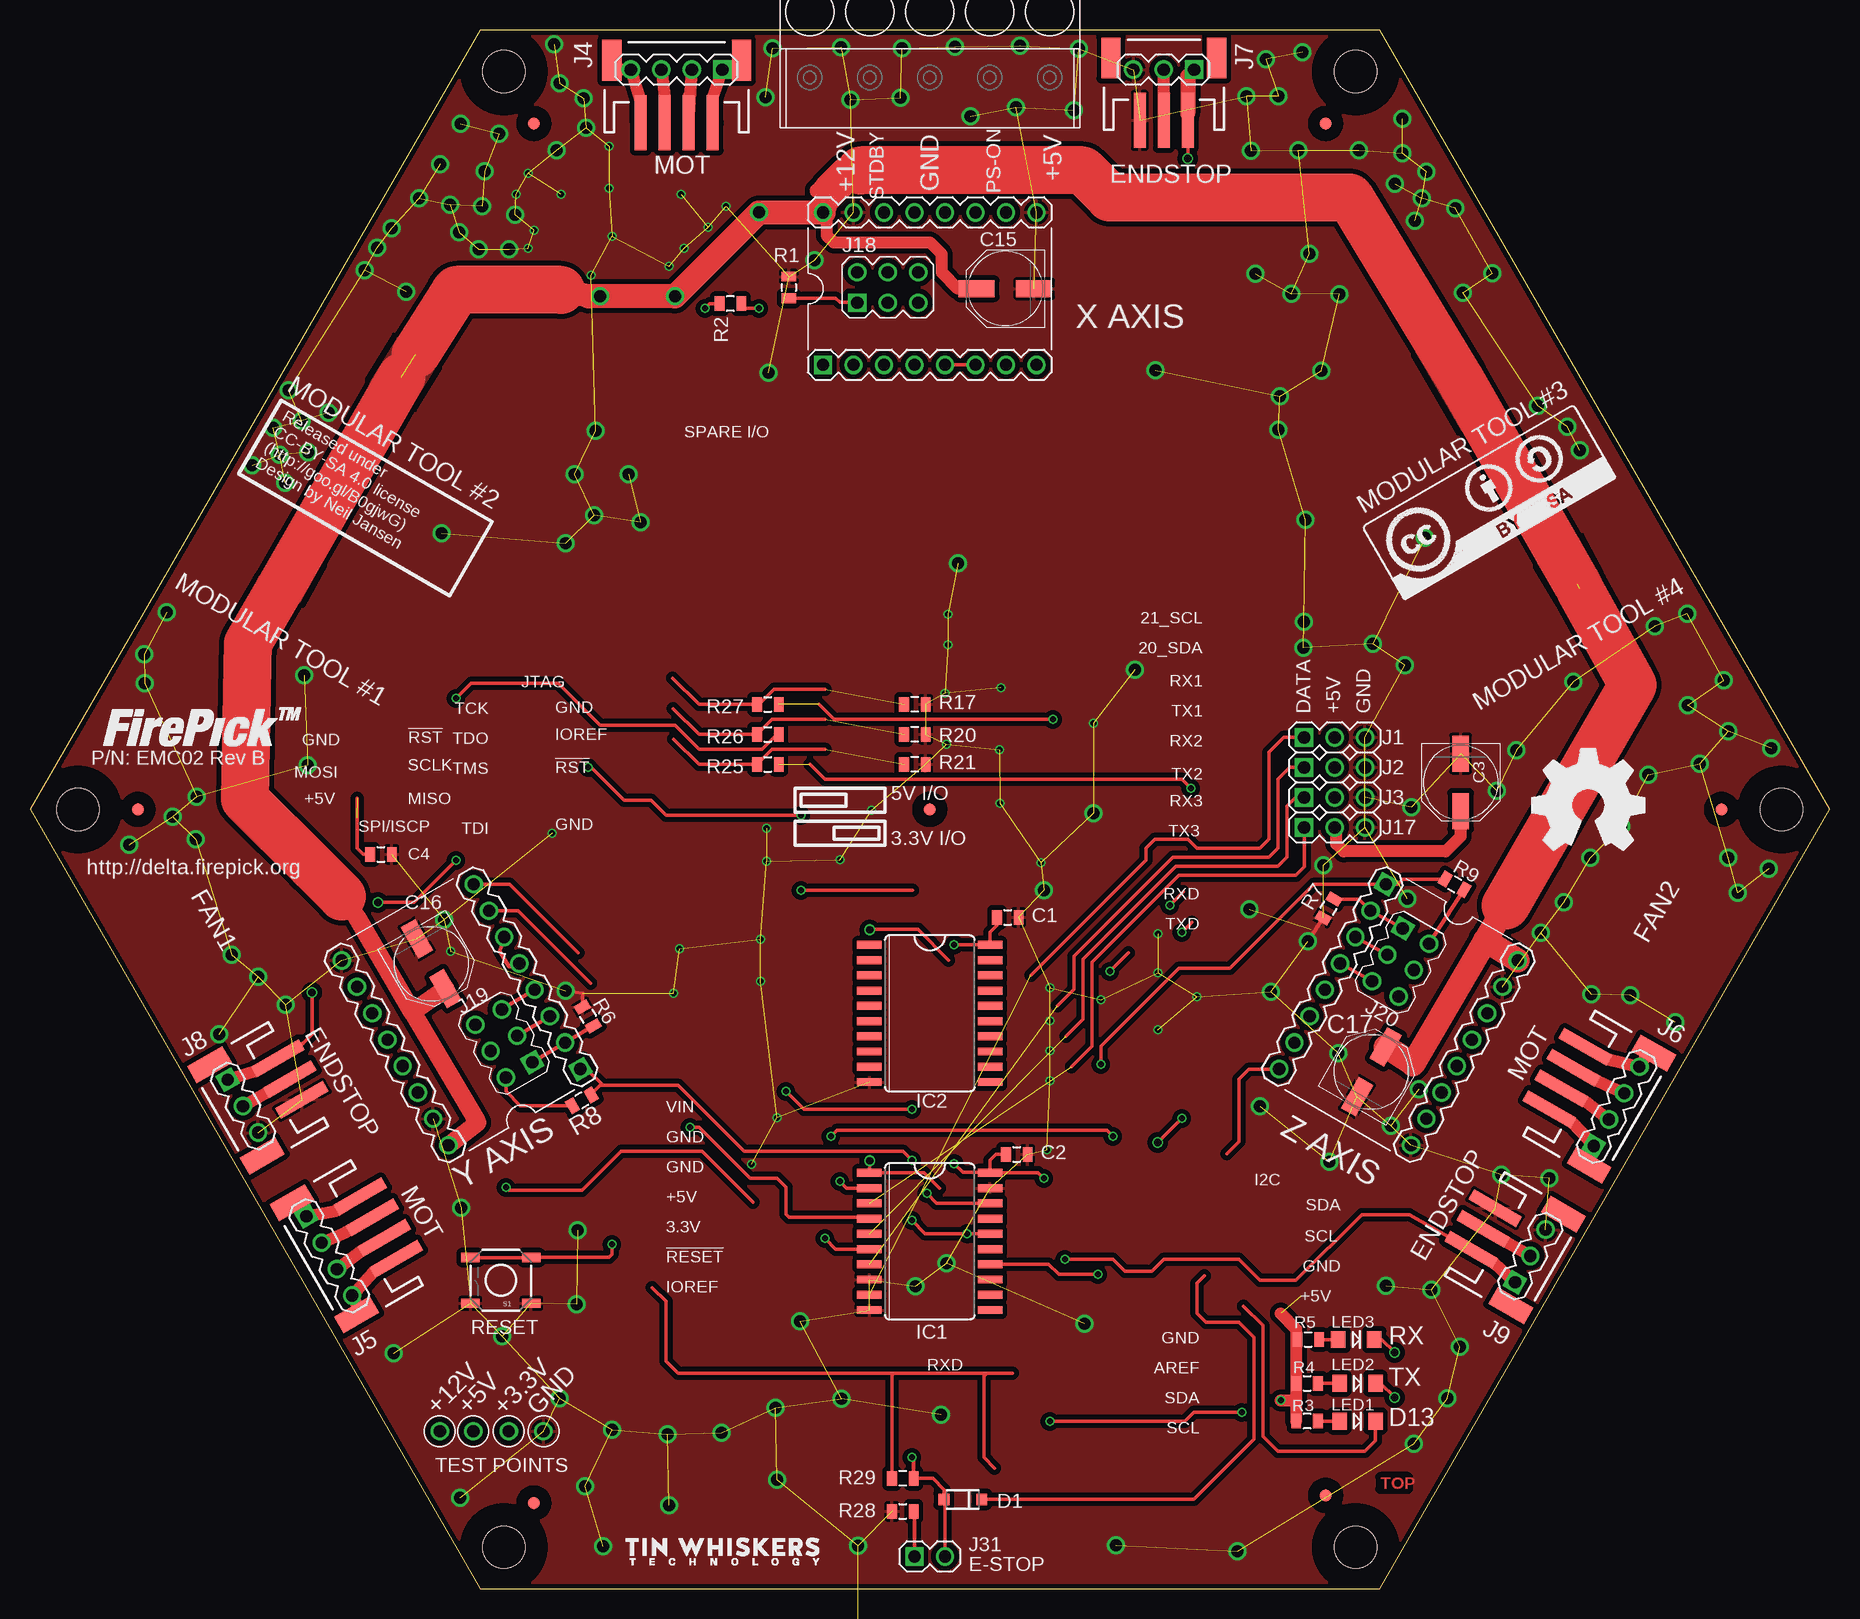
[diagram p4: board, top side]
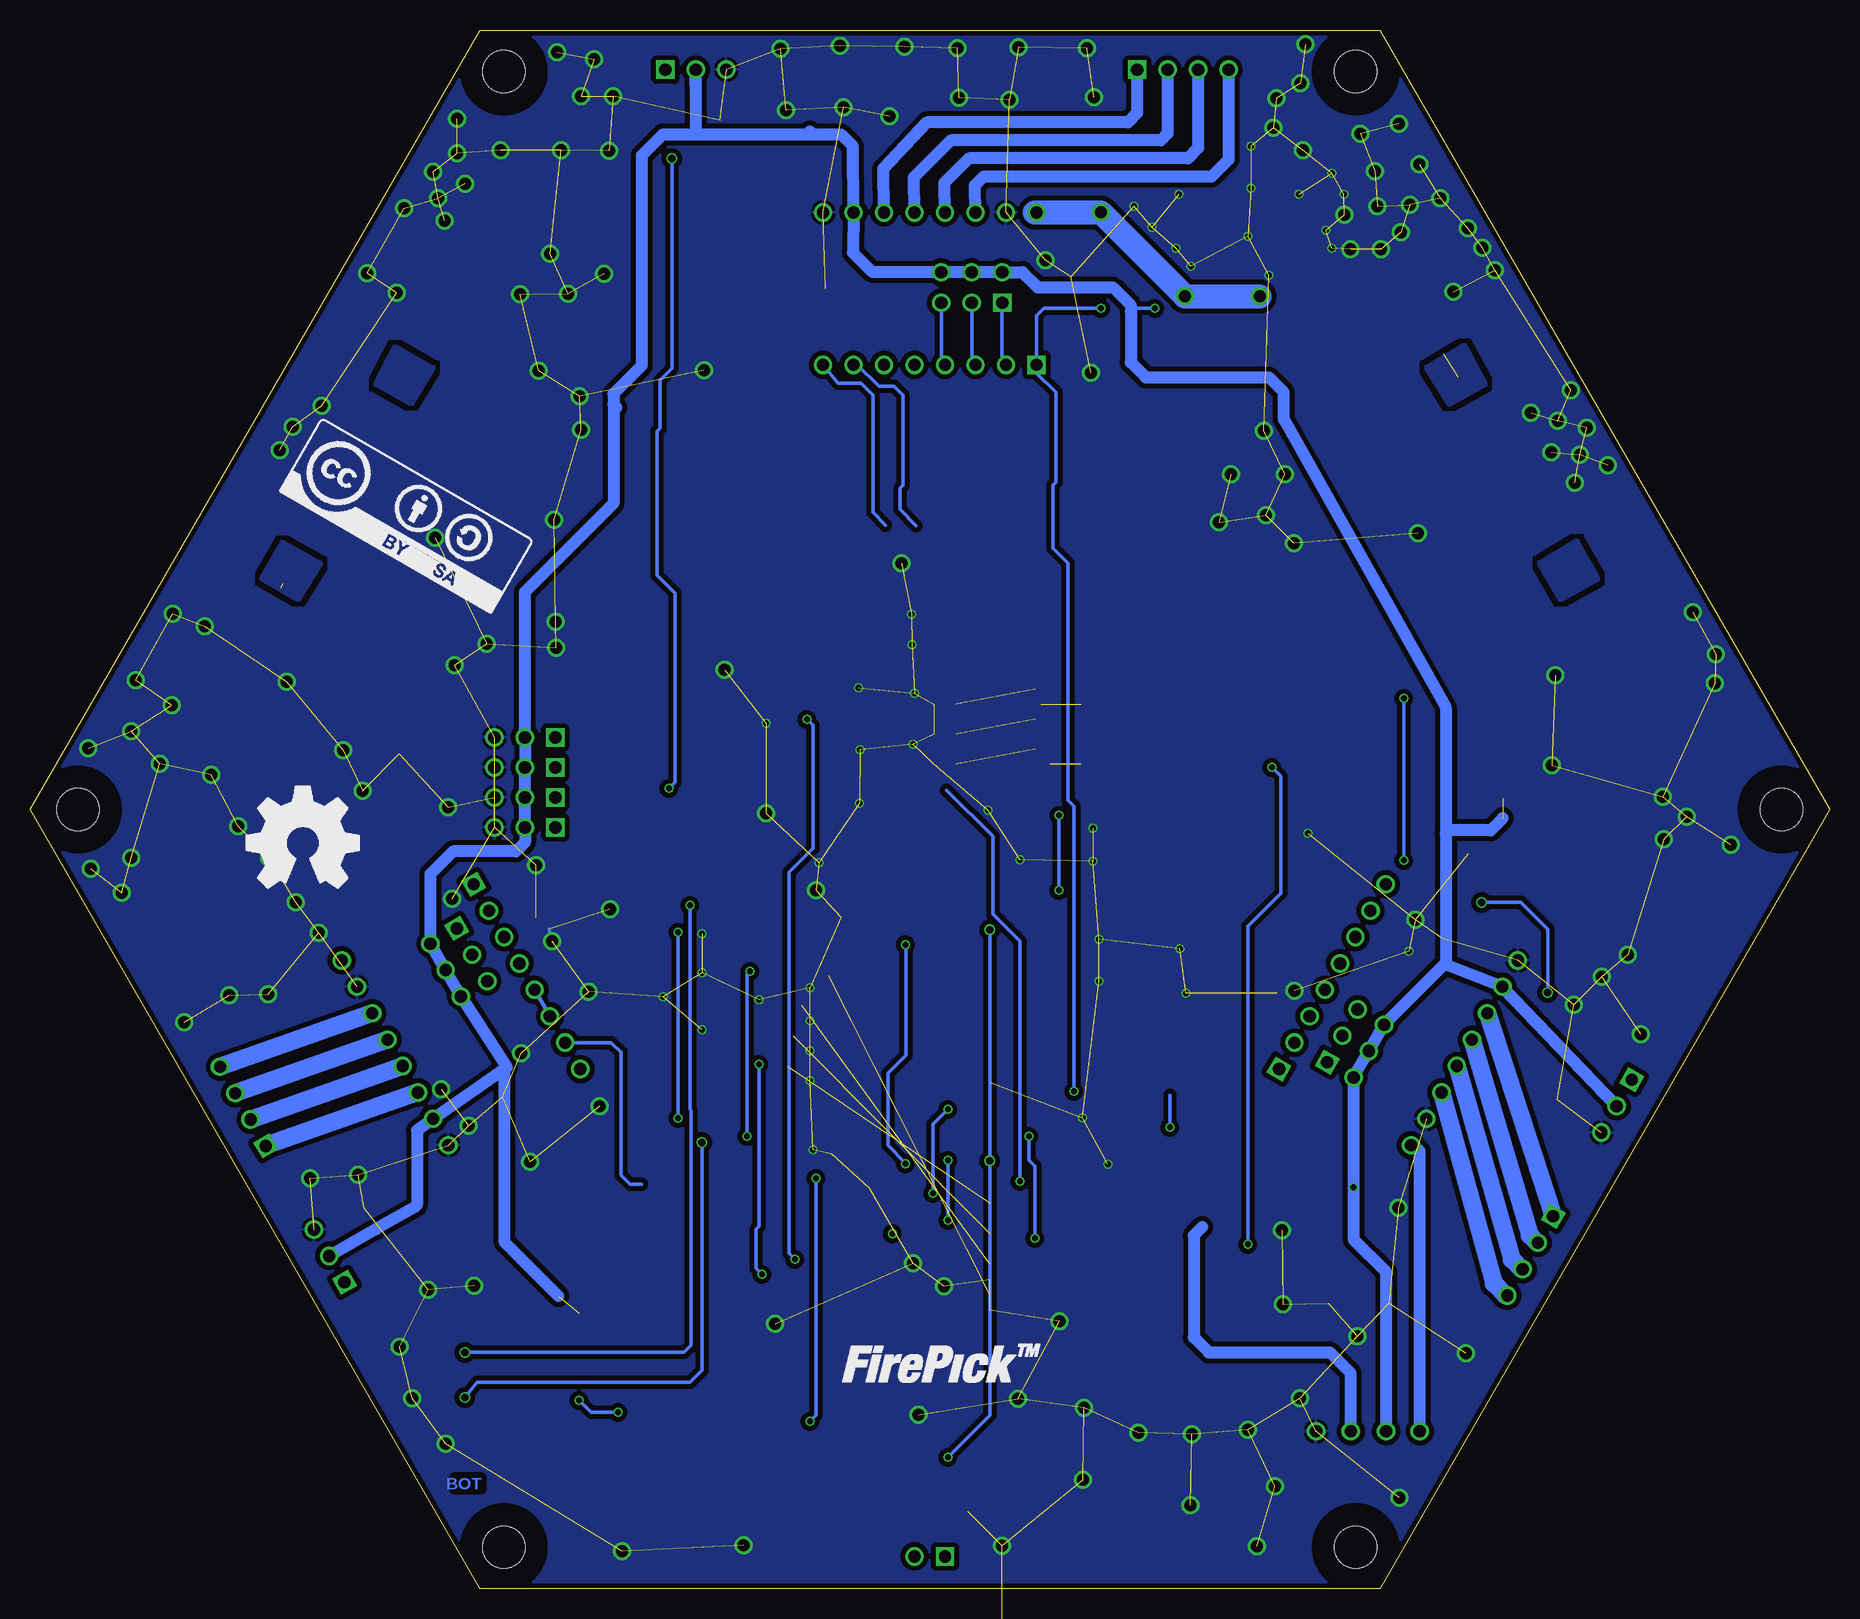
[diagram p5: board, bottom side, seen from below]

Size 150 x 129.9 mm. Coordinates in mm from the lower left corner, seen from the top.
Outline: 37.5,0 112.5,0 150,64.95 112.5,129.9 37.5,129.9 0,64.95 37.5,0
Copper layers (1*2*15*16): Top 0.035mm / dielectric 0.2mm / Route2 0.0175mm / dielectric 0.3mm / Route15 0.0175mm / dielectric 0.2mm / Bottom 0.035mm
Design rules "HQPCB_4layer_DRU_no_angle": minimum track width 6mil, minimum drill 12mil, track to track 8mil, track to pad 8mil, pad to pad 6mil, via to via 8mil, smd to smd 0mil, copper to edge 10mil, drill to drill 8mil, minimum pad ring 6mil, minimum via ring 4mil, stop-mask expansion 2mil, vias tented up to drill 100mil, thermal gap 10mil
Holes 3.5 mm at 4,64.95 39.5,3.46 110.5,3.46 146,64.95 39.5,126.44 110.5,126.44
tRestrict: area 142.8,61.7 to 149.2,68.2; area 0.8,61.7 to 7.2,68.2; area 107.2,0.2 to 113.8,6.7; area 36.2,123.2 to 42.8,129.7; area 107.2,123.2 to 113.8,129.7; area 36.2,0.2 to 42.8,6.7
bRestrict: area 0.8,61.7 to 7.2,68.2; area 107.2,123.2 to 113.8,129.7; area 142.8,61.7 to 149.2,68.2; area 36.2,0.2 to 42.8,6.7; area 107.2,0.2 to 113.8,6.7; area 36.2,123.2 to 42.8,129.7

### Footprints (pad centres in the part's own frame; a part is rotated, then mirrored left to right if it is on the bottom)
0805 = smd 0.8 x 1.2: 1 -0.9,0; 2 0.9,0
PANASONIC_D = smd 3 x 1.4: + 2.4,0; - -2.4,0
C0603 = smd 0.8 x 1: 1 -0.725,0; 2 0.725,0
C-RAD-6.3MM = drill 0.5 pad 0.75 square: NEG 0,1.25 | drill 0.5 pad 0.75: POS 0,-1.25
C-SMD-4MM = smd 3.4 x 0.9: NEG -2.1,0; POS 2.1,0
SOD-123 = smd 0.9 x 0.95: A 1.575,0; C -1.575,0
F0603 = smd 1.1 x 1: 1 -0.8,0; 2 0.8,0
FIDUCIAL = smd 1 x 1: 1 0,0
SO20W = smd 0.66 x 2.032: 1 -5.715,-5.029; 2 -4.445,-5.029; 3 -3.175,-5.029; 4 -1.905,-5.029; 5 -0.635,-5.029; 6 0.635,-5.029; 7 1.905,-5.029; 8 3.175,-5.029; 9 4.445,-5.029; 10 5.715,-5.029; 11 5.715,5.029; 12 4.445,5.029; 13 3.175,5.029; 14 1.905,5.029; 15 0.635,5.029; 16 -0.635,5.029; 17 -1.905,5.029; 18 -3.175,5.029; 19 -4.445,5.029; 20 -5.715,5.029
MA03-1 = drill 1.016 square: 1 -2.54,0 | drill 1.016: 2 0,0; 3 2.54,0
MA04-1 = drill 1.016 square: 1 -3.81,0 | drill 1.016: 2 -1.27,0; 3 1.27,0; 4 3.81,0
CONN-JST-PH_2.0MM_4PIN-SMT-RA = smd 1 x 4.6: 1 3,-2.43; 2 1,-2.43; 3 -1,-2.43; 4 -3,-2.43 | smd 1.6 x 3.4: NC1 -5.4,2.77; NC2 5.4,2.77
CONN-JST_PH-2.0MM-3PIN-SMT-RA = smd 1 x 4.6: 1 2.01,-2.23; 2 0.01,-2.23; 3 -1.99,-2.23 | smd 1.6 x 3.4: NC1 -4.39,2.97; NC2 4.41,2.97
CON-HDR-6POS-MALE = drill 1.25 square: 1 -6.35,0 | drill 1.25: 2 -3.8,0; 3 -1.26,0; 4 1.28,0; 5 3.85,0; 6 6.39,0
MAGJACK(HR911105A) = drill 1.15: 1 4.44,-6.35; 2 3.18,-8.89; 3 1.9,-6.35; 4 0.64,-8.89; 5 -0.64,-6.35; 6 -1.9,-8.89; 7 -3.18,-6.35; 8 -4.44,-8.89 | drill 1.27: 9 6.625,4.9; 10 4.085,4.9; 11 -4.085,4.9; 12 -6.625,4.9 | drill 3.5: SHLD0 5.715,0; SHLD1 -5.715,0 | hole 1.7: -7.745,-3.05; 7.745,-3.05
MICRO-SD-SOCKET-PP = smd 0.8 x 1.5: 1 -8.94,10.7; 2 -7.84,10.3; 3 -6.74,10.7; 4 -5.64,10.9; 5 -4.54,10.7; 6 -3.44,10.9; 7 -2.34,10.7; 8 -1.24,10.7 | smd 1.8 x 1.4: CD1 -7.75,0.4; CD2 -2.05,0.4 | smd 1.4 x 1.9: GND1 -13.6,14.55; GND2 -0.45,13.55
USB-B(THRU) = drill 0.95: 1 1.25,1; 2 -1.25,1; 3 -1.25,-1; 4 1.25,-1 | hole 2.3: -6.02,-3.71; 6.02,-3.71
FTSH-105-01-XXX-DV-K = smd 0.737 x 2.794: 1 -2.54,-2.032; 2 -2.54,2.032; 3 -1.27,-2.032; 4 -1.27,2.032; 5 0,-2.032; 6 0,2.032; 7 1.27,-2.032; 8 1.27,2.032; 9 2.54,-2.032; 10 2.54,2.032
MA03-2 = drill 1.016 square: 1 -2.54,-1.27 | drill 1.016: 2 -2.54,1.27; 3 0,-1.27; 4 0,1.27; 5 2.54,-1.27; 6 2.54,1.27
MA02-1 = drill 1.016 square: 1 -1.27,0 | drill 1.016: 2 1.27,0
LED-1206-NO_SILK = smd 1.2 x 1.4: A -1.5,0; C 1.5,0
LED0603 = smd 1.1 x 1: A -0.85,0; C 0.85,0
HC-49/U-S = smd 5.5 x 1.5: 1 -4.25,0; 2 4.25,0
R0603 = smd 0.9 x 1: 1 -0.8,0; 2 0.8,0
CON-RJ45 = smd 0.6 x 3.05: 1 -3.556,0; 2 -2.54,0; 3 -1.524,0; 4 -0.508,0; 5 0.508,0; 6 1.524,0; 7 2.54,0; 8 3.556,0 | drill 1.27 pad 3.5 square: LCK1 -6.75,-8; LCK2 6.75,-8
TACTILE_SWITCH_SMD = smd 1.524 x 0.762: 1 -2.54,1.905; 2 2.54,1.905; 3 -2.54,-1.905; 4 2.54,-1.905
SMS-001 = smd 1.092 x 2.007: 1 0,-4.496; 2 0,4.496
0603 = smd 1.1 x 1: 1 -0.85,0; 2 0.85,0
STEPSTICK = drill 1.016: 1A 6.35,-1.27; 1B 6.35,-3.81; 2A 6.35,1.27; 2B 6.35,3.81; !RESET! -6.35,-1.27; !SLEEP! -6.35,-3.81; DIR -6.35,-8.89; GND 6.35,6.35; GND@2 6.35,-8.89; MS1 -6.35,6.35; MS2 -6.35,3.81; MS3 -6.35,1.27; STEP -6.35,-6.35; VDD 6.35,-6.35; VMOT 6.35,8.89 | drill 1.016 square: !ENABLE! -6.35,8.89
CON-TESTPOINT = drill 1.016: 1 0,0
LQFP-100 = smd 0.4 x 1.5: 1 -6.05,-7.9; 25 6.05,-7.9; 51 6.05,7.9; 75 -6.05,7.9 | smd 0.28 x 1.5: 2 -5.5,-7.9; 3 -5,-7.9; 4 -4.5,-7.9; 5 -4,-7.9; 6 -3.5,-7.9; 7 -3,-7.9; 8 -2.5,-7.9; 9 -2,-7.9; 10 -1.5,-7.9; 11 -1,-7.9; 12 -0.5,-7.9; 13 0,-7.9; 14 0.5,-7.9; 15 1,-7.9; 16 1.5,-7.9; 17 2,-7.9; 18 2.5,-7.9; 19 3,-7.9; 20 3.5,-7.9; 21 4,-7.9; 22 4.5,-7.9; 23 5,-7.9; 24 5.5,-7.9; 52 5.5,7.9; 53 5,7.9; 54 4.5,7.9; 55 4,7.9; 56 3.5,7.9; 57 3,7.9; 58 2.5,7.9; 59 2,7.9; 60 1.5,7.9; 61 1,7.9; 62 0.5,7.9; 63 0,7.9; 64 -0.5,7.9; 65 -1,7.9; 66 -1.5,7.9; 67 -2,7.9; 68 -2.5,7.9; 69 -3,7.9; 70 -3.5,7.9; 71 -4,7.9; 72 -4.5,7.9; 73 -5,7.9; 74 -5.5,7.9 | smd 1.5 x 0.4: 26 7.9,-6.05; 50 7.9,6.05; 76 -7.9,6.05; 100 -7.9,-6.05 | smd 1.5 x 0.28: 27 7.9,-5.5; 28 7.9,-5; 29 7.9,-4.5; 30 7.9,-4; 31 7.9,-3.5; 32 7.9,-3; 33 7.9,-2.5; 34 7.9,-2; 35 7.9,-1.5; 36 7.9,-1; 37 7.9,-0.5; 38 7.9,0; 39 7.9,0.5; 40 7.9,1; 41 7.9,1.5; 42 7.9,2; 43 7.9,2.5; 44 7.9,3; 45 7.9,3.5; 46 7.9,4; 47 7.9,4.5; 48 7.9,5; 49 7.9,5.5; 77 -7.9,5.5; 78 -7.9,5; 79 -7.9,4.5; 80 -7.9,4; 81 -7.9,3.5; 82 -7.9,3; 83 -7.9,2.5; 84 -7.9,2; 85 -7.9,1.5; 86 -7.9,1; 87 -7.9,0.5; 88 -7.9,0; 89 -7.9,-0.5; 90 -7.9,-1; 91 -7.9,-1.5; 92 -7.9,-2; 93 -7.9,-2.5; 94 -7.9,-3; 95 -7.9,-3.5; 96 -7.9,-4; 97 -7.9,-4.5; 98 -7.9,-5; 99 -7.9,-5.5
SOICN-8 = smd 2.2 x 0.6: 1 -2.6,1.905; 2 -2.6,0.635; 3 -2.6,-0.635; 4 -2.6,-1.905; 5 2.6,-1.905; 6 2.6,-0.635; 7 2.6,0.635; 8 2.6,1.905
QFN-24 = smd 0.7 x 0.28: 1 -1.89,1.25; 2 -1.89,0.75; 3 -1.89,0.25; 4 -1.89,-0.25; 5 -1.89,-0.75; 6 -1.89,-1.25; 13 1.89,-1.25; 14 1.89,-0.75; 15 1.89,-0.25; 16 1.89,0.25; 17 1.89,0.75; 18 1.89,1.25 | smd 0.28 x 0.7: 7 -1.25,-1.89; 8 -0.75,-1.89; 9 -0.25,-1.89; 10 0.25,-1.89; 11 0.75,-1.89; 12 1.25,-1.89; 19 1.25,1.89; 20 0.75,1.89; 21 0.25,1.89; 22 -0.25,1.89; 23 -0.75,1.89; 24 -1.25,1.89 | smd 2.5 x 2.5: PAD 0,0
SOT-25 = smd 0.38 x 0.4: 1 0.95,1.2; 2 0,1.2; 3 -0.95,1.2; 4 -0.95,-1.2; 5 0.95,-1.2
SOT-23-5 = smd 0.7 x 1: 1 0.95,1.2; 2 0,1.2; 3 -0.95,1.2; 4 -0.95,-1.2; 5 0.95,-1.2

### Placement (x,y rotation side)
C1  81.5,55.95 0 top
C2  82.25,36.2 0 top
C3  119.25,67.2 270 top
C4  29.25,61.2 0 top
C5  129.9,-259.81 0 top  (outside the outline)
C6  129.9,-324.76 0 top  (outside the outline)
C7  194.86,-259.81 0 top  (outside the outline)
C8  194.86,-324.76 0 top  (outside the outline)
C9  259.81,-259.81 0 top  (outside the outline)
C10  259.81,-324.76 0 top  (outside the outline)
C11  324.76,-844.38 0 top  (outside the outline)
C12  389.71,-844.38 0 top  (outside the outline)
C13  324.76,-779.42 0 top  (outside the outline)
C14  324.76,-519.62 0 top  (outside the outline)
C15  81.3,108.35 180 top
C16  33.44,52.09 300 top
C17  111.81,43.09 60 top
C18  389.71,-779.42 0 top  (outside the outline)
C19  454.66,-779.42 0 top  (outside the outline)
C20  129.9,-779.42 0 top  (outside the outline)
C21  259.81,-779.42 0 top  (outside the outline)
C22  389.71,-519.62 0 top  (outside the outline)
C23  64.95,-844.38 0 top  (outside the outline)
C24  129.9,-844.38 0 top  (outside the outline)
C25  194.86,-844.38 0 top  (outside the outline)
C26  454.66,-844.38 0 top  (outside the outline)
C27  324.76,-324.76 0 top  (outside the outline)
C28  324.76,-259.81 0 top  (outside the outline)
C29  64.95,-324.76 0 top  (outside the outline)
C30  64.95,-909.33 0 top  (outside the outline)
C31  129.9,-909.33 0 top  (outside the outline)
C32  194.86,-909.33 0 top  (outside the outline)
C33  259.81,-909.33 0 top  (outside the outline)
C34  259.81,-844.38 0 top  (outside the outline)
C35  324.76,-909.33 0 top  (outside the outline)
C36  389.71,-909.33 0 top  (outside the outline)
D1  77.75,7.45 180 top
FB1  194.86,-974.28 0 top  (outside the outline)
FB2  324.76,-454.66 0 top  (outside the outline)
FID1  9,64.95 0 top
FID2  141,64.95 0 top
FID3  42,122.11 0 top
FID4  42,7.15 0 top
FID5  108,7.79 0 top
FID6  75,64.95 0 top
FID7  108,122.11 0 top
IC1  75,28.95 270 top
IC2  75,47.95 270 top
J1  108.75,70.95 0 top
J2  108.75,68.45 0 top
J3  108.75,65.95 0 top
J4  53.9,126.6 180 top
J4A  53.9,124.6 0 top
J5  24.94,27.75 300 top
J5A  26.94,28.9 120 top
J6  132.25,40.21 60 top
J6A  130.26,41.36 240 top
J7  94.5,126.6 180 top
J7A  94.5,124.6 0 top
J8  17.75,40.23 300 top
J8A  19.74,41.36 120 top
J9  125.06,27.75 60 top
J9A  123.06,28.9 240 top
J10  64.95,-259.81 0 top  (outside the outline)
J11  129.9,-519.62 0 top  (outside the outline)
J12  64.95,-519.62 0 top  (outside the outline)
J13  194.86,-519.62 0 top  (outside the outline)
J14  454.66,-714.47 0 top  (outside the outline)
J17  108.75,63.45 0 top
J18  71.5,108.45 0 top
J19  39.5,45.45 120 top
J20  114.25,52.2 240 top
J22A  75,125.95 0 top
J31  75,2.7 0 top
LED1  110.65,13.98 0 top
LED2  110.65,17.13 0 top
LED3  110.55,20.78 0 top
LED4  194.86,-389.71 0 top  (outside the outline)
LED5  259.81,-389.71 0 top  (outside the outline)
LED6  324.76,-389.71 0 top  (outside the outline)
LED7  64.95,-454.66 0 top  (outside the outline)
LED8  194.86,-454.66 0 top  (outside the outline)
LED9  259.81,-454.66 0 top  (outside the outline)
LED10  129.9,-454.66 0 top  (outside the outline)
LOGO1  82.5,15.45 0 bottom
LOGO2  127.25,62.2 0 bottom
LOGO3  129.25,91.45 330 bottom
LOGO4  5.9,68.5 0 top
LOGO5  129.9,65.35 0 top
LOGO6  114.55,82.38 30 top
LOGO7  64.95,-64.95 0 top  (outside the outline)
LOGO8  64.95,-129.9 0 top  (outside the outline)
Q1  194.86,-779.42 0 top  (outside the outline)
R1  63.25,108.45 270 top
R2  58.38,107.1 180 top
R3  106.45,13.98 180 top
R4  106.45,17.13 0 top
R5  106.55,20.78 0 top
R6  46.5,47.7 300 top
R7  108.25,56.7 60 top
R8  46,40.7 210 top
R9  118.75,58.7 330 top
R10  64.95,-649.52 0 top  (outside the outline)
R11  129.9,-649.52 0 top  (outside the outline)
R12  194.86,-649.52 0 top  (outside the outline)
R13  259.81,-649.52 0 top  (outside the outline)
R14  454.66,-519.62 0 top  (outside the outline)
R15  324.76,-649.52 0 top  (outside the outline)
R16  389.71,-649.52 0 top  (outside the outline)
R17  73.75,73.7 180 top
R18  454.66,-649.52 0 top  (outside the outline)
R19  194.86,-194.86 0 top  (outside the outline)
R20  73.75,71.2 180 top
R21  73.75,68.7 180 top
R22  64.95,-584.57 0 top  (outside the outline)
R23  259.81,-194.86 0 top  (outside the outline)
R24  324.76,-194.86 0 top  (outside the outline)
R25  61.5,68.7 0 top
R26  61.5,71.2 0 top
R27  61.5,73.7 0 top
R28  72.75,6.45 0 top
R29  72.75,9.2 180 top
R30  129.9,-584.57 0 top  (outside the outline)
R31  194.86,-584.57 0 top  (outside the outline)
R32  259.81,-584.57 0 top  (outside the outline)
R33  64.95,-714.47 0 top  (outside the outline)
R34  324.76,-584.57 0 top  (outside the outline)
R35  389.71,-584.57 0 top  (outside the outline)
R36  129.9,-714.47 0 top  (outside the outline)
R37  194.86,-714.47 0 top  (outside the outline)
R38  259.81,-714.47 0 top  (outside the outline)
R39  324.76,-714.47 0 top  (outside the outline)
R40  389.71,-714.47 0 top  (outside the outline)
R41  454.66,-584.57 0 top  (outside the outline)
RJ1  259.81,-519.62 0 top  (outside the outline)
S1  39.25,25.7 180 top
S2  129.9,-194.86 0 top  (outside the outline)
S3  64.95,-389.71 0 top  (outside the outline)
S4  129.9,-389.71 0 top  (outside the outline)
STEPSTICK1  75,108.35 90 top
STEPSTICK2  35.94,47.84 210 top
STEPSTICK3  114.06,47.84 330 top
TP2  34.16,13.13 0 top
TP3  42.79,13.13 0 top
TP4  36.96,13.13 0 top
TP5  39.91,13.13 0 top
U1  64.95,-194.86 0 top  (outside the outline)
U2  64.95,-779.42 0 top  (outside the outline)
U3  454.66,-909.33 0 top  (outside the outline)
U4  129.9,-974.28 0 top  (outside the outline)
U5  64.95,-974.28 0 top  (outside the outline)
U$25  50,1.45 0 top

### Tracks (layer width: path | path; a pad name or v marks a point on that pad's centre or on a via)
3.3V
  Bottom 1: TP5.1 39.91,17.95 41.66,19.7 51.75,19.7 53,20.95 53,29.45 52.29,30.16
12V  (via drill 1)  (2 unrouted)
  Top 0.3: 20.75,83.28 21.57,85.08 | 37.25,38.95 37.25,38.91 37.31,38.84 | 35.41,108 35.39,108.02
  Top 1: C15.+ 77.35,108.35 76,109.7 76,111.2 75,112.2 67,112.2 66.41,112.79 66.41,114.2 66.16,114.45 | 65.5,116.45 65.5,116.55 65.85,116.9 66.45,116.9 | 65.75,114.45 66.16,114.45 | 66.16,114.45 STEPSTICK1.VMOT
  Top 1.5: STEPSTICK2.VMOT 37.31,38.84 | 37.25,38.95 31.89,48.03 | 31.89,48.03 27.25,55.95 26,57.7 | C16.+ 31.89,48.03
  Top 2: 123,56.95 121.31,54.06 | 121.31,54.06 115.25,43.7 C17.+ | STEPSTICK3.VMOT 121.31,54.06 | 66.45,116.9 67.75,118.2 68.25,118.2 | 68.25,118.2 69.25,118.2 | 68.25,118.2 68.25,117.45 66.41,115.61 STEPSTICK1.VMOT 66.16,114.7 v60.75,114.7 v53.75,107.7 46.57,107.7 44.27,108.25
  Top 4: 30.95,100.98 20.75,83.28 18.15,78.78 18.11,76.94 17.9,65.8 23.5,60.2 26,57.7 | 128.95,83.78 119.15,100.88 110,115.95 90,115.95 87.75,118.2 69.25,118.2 | 129.15,83.38 133.3,75.87 133.6,75.33 125.48,61.25 123,56.95 | 44.27,108.25 35.55,108.25 35.5,108.2 35.39,108.02 32.13,102.87
  Bottom 1: TP2.1 34.16,36.5 STEPSTICK2.VMOT
  Bottom 2: 66.25,114.7 v60.75,114.7 v53.75,107.7 v47.5,107.7
  pour Top (no thermals): 115.55,103.28 119.45,96.58 122.55,98.28 118.65,105.08
  pour Bottom (no thermals): 119.55,103.58 116.35,101.78 118.25,98.68 121.25,100.38
  pour Bottom (no thermals): 128.95,87.28 125.75,85.48 127.65,82.38 130.75,84.18
  pour Bottom (isolate 0.406, no thermals): 19.25,84.18 21.05,87.38 24.25,85.48 22.45,82.38
  pour Bottom (isolate 0.406, no thermals): 28.65,100.38 30.45,103.68 33.65,101.78 31.75,98.68
  pour Top (no thermals): 128.95,87.48 125.75,85.58 127.65,82.48 130.65,84.28
  pour Top (no thermals): 30.75,104.18 28.45,100.38 31.65,98.58 33.85,102.18
  pour Top (no thermals): 21.25,87.58 19.25,84.08 22.35,82.28 24.25,85.78
!RESET  (via drill 0.5)
  Top 0.3: S1.4 S1.3 41.81,27.62 48.25,27.62 48.5,27.87 v48.5,28.7 | v46.5,68.45 46.75,68.45 49.5,65.7 51.75,65.7 53,64.45 v64.25,64.45 | v64.25,58.2 73.57,58.2
  Bottom 0.3: v48.5,28.7 48.5,55.2 45.75,57.95 45.75,67.7 v46.5,68.45 | v64.25,64.45 v64.25,58.2
!X_ENABLE  (via drill 0.5)
  Top 0.3: IC1.18 75.58,32.13 v74.75,32.95 | v73.5,39.95 64.5,39.95 v63,41.45 | 59.15,107.3 R2.1 59.67,106.7 v60.75,106.7
  Bottom 0.3: v63,41.45 63,65.2 63.5,65.7 63.5,85.45 64.75,86.7 64.75,91.95 64.5,92.2 64.5,99.7 66.11,101.31 STEPSTICK1.!ENABLE! 66.11,106.09 65.5,106.7 v60.75,106.7 | v74.75,32.95 74.75,38.7 v73.5,39.95
!X_ENABLE_BUF  (via drill 0.5)
  Top 0.3: IC1.2 68.06,33.4 v67.5,33.95
  Bottom 0.3: v67.5,33.95 67.5,53.95 69.75,56.2 69.75,62.7 73.6,66.55
!Y_ENABLE  (via drill 0.5)
  Top 0.3: 47.75,41.95 47.5,41.95 46.78,41.23 R8.1 | 47.75,41.95 54,41.95 59.5,36.45 72.75,36.45 v73.5,35.7 | IC1.16 v78.11,29.59 74.61,29.59 v73.5,30.7 | STEPSTICK2.!ENABLE! 46.38,43.32 47.75,41.95
  Bottom 0.3: v73.5,30.7 v73.5,35.7
!Y_ENABLE_BUF  (via drill 0.5)
  Top 0.3: v55,38.45 55.75,38.45 60,34.2 62.25,34.2 63,33.45 63,31.2 63.25,30.95 69.88,30.95 IC1.4
  Bottom 0.3: v55,38.45 55,41.15
!Z_ENABLE  (via drill 0.5)
  Top 0.3: v89,26.2 85.75,26.2 84.91,27.05 IC1.14 | R9.1 114.45,59.15 114.01,58.72 STEPSTICK3.!ENABLE! 107.01,58.72 100,51.7 95.75,51.7 89.25,45.2 v89.25,43.7
  Bottom 0.3: v89.25,43.7 89.25,30.2 89.5,29.95 89.5,26.7 v89,26.2
!Z_ENABLE_BUF  (via drill 0.5)
  Top 0.3: 91.57,53.02 v90,51.45 | IC1.6 67.14,28.32 v66.25,29.2 | v66.75,37.7 67.25,38.2 89.75,38.2 v90.25,37.7
  Bottom 0.3: v66.25,29.2 66.25,35.2 66.75,35.7 v66.75,37.7 | v90.25,37.7 90.25,51.2 v90,51.45
+3V3  (20 unrouted)
+5V  (via drill 0.5)  (2 unrouted)
  Top 0.3: J20.2 R9.2 | v77.03,53.67 IC2.20 80,53.7 80,54.7 80.6,55.3 C1.1 | v101,14.7 97,14.7 96.25,13.95 92.25,13.95 v85,13.95 | R5.1 105.62,20.78 105.55,20.7 | IC1.20 84.03,34.67 v84.5,34.2 | IC1.20 80,34.7 77.76,34.7 v77.03,35.42 77.03,35.49 77,35.45 | C2.1 80.5,36.2 80.03,35.73 IC1.20 | R8.2 40.87,40.25 39.67,41.45 J19.2 | 27.25,65.89 27.25,61.7 27.75,61.2 C4.1 | 60.25,32.2 56,36.45 49.25,36.45 46,33.2 39.92,33.2 v39.67,33.45 | R2.2 56.65,107.1 v56.25,106.7
  Top 0.5: 105.5,13.93 R3.2
  Top 1: J9.2 J9A.2 | J8.2 J8A.2 | J7A.2 J7.2 | J17.2 108.88,63.33 108.88,62.08 109.5,61.45 118,61.45 119.25,62.7 C3.+ | R3.2 105.55,15.7 | 105.55,15.7 R4.1 105.55,20.7 105.55,21.65 104.25,22.95 | v104.25,15.7 105.55,15.7
  Bottom 0.3: v101,14.7 103.25,14.7 v104.25,15.7 | v84.5,34.2 84.5,14.45 v85,13.95 | v77.03,35.42 77.03,35.49 78.5,36.95 78.5,42.95 77,44.45 77,53.63 v77.03,53.67 | v56.25,106.7 58,106.7 58.25,106.45
  Bottom 1: J7.2 | TP4.1 36.96,26.41 39.67,29.12 v39.67,33.45 J19.2 J19.4 J19.6 32.1,52.05 | 110.42,43.34 STEPSTICK3.VDD 117.75,38.2 117.75,31.99 117.92,31.82 J9A.2 J9.2 | 110.42,43.34 110.25,43.45 J20.6 J20.4 J20.2 116.62,59.58 114.75,61.45 109.5,61.45 108.75,62.2 J17.2 J3.2 J2.2 J1.2 108.75,83.07 101.37,90.45 101.37,98.7 | 94.5,125.2 J7.2 | 101.37,98.7 101.37,99.58 99,101.95 99,119.45 97.25,121.2 94.5,121.2 | J8.2 STEPSTICK2.VDD 32.1,52.05 | 105.94,24.39 110.42,28.87 110.42,43.34 | 32,62.95 32,73.45 45.5,97.45 45.5,99.7 46.75,100.95 57,100.95 58.25,102.2 58.25,106.45 58.25,106.95 59.75,108.45 66,108.45 67.27,109.72 J18.2 J18.4 J18.6 | 32,62.95 32,52.15 32.1,52.05 | 27.23,64.22 28.25,63.2 31.75,63.2 32,62.95 | 94.5,121.2 84.75,121.2 | 84.75,121.2 82.4,121.2 81.4,120.2 STEPSTICK1.VDD 81.4,111.35 79.77,109.72 J18.6 | 85,121.45 84.75,121.2 | 94.5,121.2 J7.2 | 101.12,98.45 101.37,98.7 | J18.6 74.48,109.72 74.5,109.7
A  (3 unrouted)
AVR_RXD  (via drill 0.5, 0.6)
  Top 0.3: LED3.C 112.67,20.78 v113.75,19.7 | 96.15,58.1 v95,56.95
  Bottom 0.3: v95,56.95 95,39.95 94.9,39.85 94.9,20.3 95.5,19.7 v113.75,19.7
AVR_TXD  (via drill 0.5, 0.6)
  Top 0.3: LED2.C 112.58,17.13 v113.75,15.95 | 94.11,37.31 v94,37.2 v96,39.2 | 96.86,55.56 v96,54.7
  Bottom 0.3: v113.75,15.95 112.75,17.2 95,17.2 94,18.2 v94,37.2 | v96,54.7 v96,39.2
B  (3 unrouted)
D13_LED
  Top 0.3: LED1.C 112.15,12.35 111.25,11.45 104,11.45 102.75,12.7 102.75,21.95 101.14,23.56
DFU  (2 unrouted)
DI  (1 unrouted)
DTR  (1 unrouted)
DTR1  (2 unrouted)
ESTOP
  Top 0.3: D1.C 97,7.45 102,12.45 102,20.95 100.75,22.2 98,22.2 97.25,22.95 97.25,25.45 97.9,26.1
ESTOP_OE  (via drill 0.5, 0.6)
  Top 0.3: v70,35.67 IC1.1 74.53,34.67 75.81,33.4 | J31.2 76.27,7.36 D1.A 76.17,8.28 75.25,9.2 R29.1 73.65,10.8 v73.5,10.95 | 76.56,52.4 74,54.95 70.03,54.95 v70,54.92
  Bottom 0.3: v70,54.92 v70,35.67 70,14.45 v73.5,10.95
ETH_CRS_DV  (1 unrouted)
ETH_MDC  (1 unrouted)
ETH_MDIO  (2 unrouted)
ETH_REF_CLK  (1 unrouted)
ETH_RX_ER  (2 unrouted)
ETH_RXD0  (1 unrouted)
ETH_RXD1  (1 unrouted)
ETH_TX_EN  (1 unrouted)
ETH_TXD0  (1 unrouted)
ETH_TXD1  (1 unrouted)
GND  (via drill 0.5, 1)  (301 unrouted)
  Top 0.3: R7.1 v106.5,53.95 | R6.1 46.05,49.65 v44.62,49.83
  Bottom 0.3: v106.5,53.95 106.75,54.95 | v44.62,49.83 44.5,49.45
  other vias: 115.75,41.63 43.7,128.7 37.7,115.2 64.2,22.3 27.9,109.9 46.35,121.75 28.95,111.75 82.17,123.48 21.55,99.88 16.8,52.85 34.3,87.95 47.75,3.55 122.65,34.5 19,51 39.35,21.05 37.9,118.15 84.5,58.2 75.95,14.5 114.4,119.65 77.1,128.5 61.55,101.35 102.15,109.6 104.05,124.4 119.45,108 103,127.45 101.75,119.85 113.75,117.08 138.18,73.63 106.05,128.05 115.45,114 138.12,81.28 31.35,108.1 105.15,107.93 11.4,81.38 115.35,12.08 24.9,98.03 22.65,97.33 23.2,94.73 34.2,118.73 20.25,96.78 21.25,92.18 45.55,23.73 18.5,93.63 77.35,85.48 20.8,94.53 62.15,15.08 9.55,75.48 11.9,64.35 125.7,98.58 141.18,75.73 128.12,96.85 141.57,71.45 87.9,22.1 35.75,113.05 106.17,80.6 30.3,19.63 9.5,77.88 128.62,75.6 132.65,63.55 134.9,67.85 135.45,80.2 139.18,68.75 144.95,60 80.95,75.08 104.2,99.4 76.53,81.2 142.35,58 127.85,57.2 125.95,54.68 116.8,24.93 92.1,76.58 62.25,9.08 80.8,69.93 53.27,6.95 35.95,31.78 103.45,49.78 67.5,60.78 126.65,34.23 108.3,35.58 76.5,78.68 21.3,48.68 80.85,65.48 35.05,53.13 109.05,44.63 119.2,20.18 13.9,66.03 107.62,101.5 129.2,94.88 111.95,78.78 73.8,25.2 114.6,76.98 22.85,76.15 106.3,89.08 113.45,38.58 13.82,62.45 87.45,128.33 15.75,46.23 8.25,62 145.15,70.05 114.8,57.5 130.15,49.55 133.4,49.48 104.05,96.58 106.15,78.43 47.15,96.5 39.1,121.25 54.15,53.35 116,115.9 67.6,128.45 84.25,60.5 35.9,122.1 32.45,115.9 116.25,87.6 61.3,124.3 82.5,128.6 40.45,114.5 39.95,111.65 72.58,124.25 105.72,119.9 113,25.25 118.8,115.05 72.7,128.4 87,123.2 35.85,7.6 30.15,113.4 49.9,92.9 115.15,65.15 50.9,88.9 45.4,92.9 44.65,87.15 37.4,111.65 43.9,119.9 101.4,124.4 123.9,69.9 109.15,107.9 121.9,109.65 114.4,122.53 93.8,101.55 130.05,60.93 141.55,60.93 44.15,15.9 76.4,27.15 70.15,64.9 60.15,35.4 88.65,72.15 88.65,64.65 61.9,128.4 23.15,68.65 45.65,29.9 118.15,15.9 101.65,56.65 76.4,70.4 53.65,49.65 61.4,63.4 61.4,60.65 60.9,54.15 53.15,12.9 100.65,3.15 47,89.45 44.12,125.45 46.12,124.2 68.38,124.08 78.38,122.7 65.38,110.7 35,115.33 57.62,13 48.5,13.25 137.15,47.23 102.53,40.23 116.4,118.08 110.78,119.9 90.53,3.65 106.65,111.28 76.28,74.65 122.28,66.53 60.9,50.65 62.27,39.28 34.52,55.78 85,50.08 85,47.33 85,44.83 43.5,62.95 107.8,60.3 85,42.33 94,51.33 94,54.58 89.25,49.08 94,46.58 97.25,49.33 48.5,112.7 58,115.2 54.5,111.7 40.5,116.2 53.25,110.2 46.75,109.45 56.5,113.45 54.25,116.2 48.25,116.7 41.5,117.95 48.25,120.2 41.5,111.7 42,113.2 44.25,116.2 84.75,36.58 67.65,15.83 69,3.58 46.25,8.55
  pour Bottom (isolate 0.406, rank 2): 37.5,129.75 0,64.85 37.5,0.05 112.5,-0.1 150,64.95 112.5,129.75
  pour Top (isolate 0.406, rank 2): 37.6,129.75 0.1,64.85 37.6,0.05 112.6,-0.1 149.85,64.95 112.6,129.75
IOREF
  Top 0.3: 51.87,25.08 53,23.95 53,18.95 54,17.95 72,17.95 | 72,17.95 79.75,17.95 | 79.75,17.95 81.9,17.95 | R29.2 71.85,17.8 72,17.95 | 80.4,10.05 79.5,10.95 79.5,17.7 79.75,17.95
ISP_COM  (2 unrouted)
LED1/REGOFF  (1 unrouted)
LED2/NINTSEL  (2 unrouted)
N$1  (1 unrouted)
N$2  (4 unrouted)
N$3  (1 unrouted)
N$4
  Top 0.3: LED1.A R3.1
N$5
  Top 0.3: J31.1 73.73,6.37 R28.2
N$6  (13 unrouted)
N$7  (1 unrouted)
N$8  (1 unrouted)
N$11
  Top 0.3: STEPSTICK1.!SLEEP! STEPSTICK1.!RESET!
N$16
  Top 0.3: STEPSTICK2.!RESET! 40.75,51.73 39.95,51.83 39.15,53.13 39.45,53.93 STEPSTICK2.!SLEEP!
N$17  (1 unrouted)
N$18  (1 unrouted)
N$19  (1 unrouted)
N$21
  Top 0.3: R4.2 LED2.A
N$22
  Top 0.3: 107.35,20.78 R5.2 LED3.A
N$23  (2 unrouted)
N$24
  Bottom 0.3: STEPSTICK3.!RESET! STEPSTICK3.!SLEEP!
NINT/REFCLK0  (1 unrouted)
RBIAS  (1 unrouted)
RD+  (3 unrouted)
RD-  (3 unrouted)
RESET  (3 unrouted)
RESET_N  (1 unrouted)
RO  (1 unrouted)
RTCK  (1 unrouted)
SD_CS  (2 unrouted)
SD_MISO  (2 unrouted)
SD_MOSI  (2 unrouted)
SD_SCK  (1 unrouted)
SERVO1  (1 unrouted)
  Top 0.3: J1.1 104.5,70.95 103.25,69.7 103.25,62.45 102.5,61.7 97.25,61.7 96.5,62.45 93.75,62.45 93,61.7 93,60.7 83.42,51.13
SERVO2  (1 unrouted)
  Top 0.3: J2.1 105,68.45 104,67.45 104,61.7 103.25,60.95 95.25,60.95 87,52.7 87,49.95 85.64,48.59
SERVO3  (1 unrouted)
  Top 0.3: J3.1 105.5,65.95 104.75,65.2 104.75,60.95 104,60.2 95.5,60.2 87.75,52.45 87.75,47.45 86.34,46.05
SERVO4  (1 unrouted)
  Top 0.3: 86.81,43.51 88.5,45.2 88.5,52.2 95.75,59.45 105.5,59.45 106.21,60.16 J17.1
SWDCLK  (1 unrouted)
SWDIO  (1 unrouted)
SWO  (1 unrouted)
TD+  (3 unrouted)
TD-  (3 unrouted)
TDI  (1 unrouted)
USB_D+  (1 unrouted)
USB_D-  (1 unrouted)
VDD  (12 unrouted)
VRIN  (2 unrouted)
VROUT  (1 unrouted)
X1A
  Top 1: 54.9,124.4 J4A.2 J4.2
  Bottom 1: J4.2 55.17,121.28 55.75,120.7 73.25,120.7 76.32,117.63 STEPSTICK1.1A
X1B
  Top 1: J4A.1 56.9,124.3 J4.1 59.2,126.6
  Bottom 1: J4.1 57.71,122.99 58.5,122.2 75.25,122.2 78.86,118.34 STEPSTICK1.1B
X2A
  Top 1: J4A.3 52.9,124.33 J4.3
  Bottom 1: J4.3 52.63,120.07 53.5,119.2 71.75,119.2 73.78,117.17 STEPSTICK1.2A
X2B
  Top 1: J4A.4 50.9,124 J4.4 48.6,126.6
  Bottom 1: STEPSTICK1.2B 71.24,116.94 71.25,116.95 70.5,117.7 51.5,117.7 50.09,119.11 J4.4
X_DIR
  Bottom 0.3: 78.68,88.63 79.75,89.7 79.75,99.45 80.75,100.45 82.64,100.45 STEPSTICK1.DIR
X_MIN_PIN  (1 unrouted)
  Top 0.3: 66.25,69.95 61.85,69.95 R25.1 | 60.58,68.68 R25.1 | 53.65,70.8 55.75,68.7 R25.1
X_MS1
  Top 0.3: J18.1 68.94,107.2 67.5,107.2 67.15,107.55 R1.2
  Bottom 0.3: J18.1 68.96,102.31 STEPSTICK1.MS1
X_MS2
  Bottom 0.3: J18.3 71.5,102.31 STEPSTICK1.MS2
X_MS3
  Bottom 0.3: J18.5 74.04,102.31 STEPSTICK1.MS3
X_STEP
  Bottom 0.3: 76.14,88.59 77.5,89.95 77.5,91.7 77.25,91.95 77.25,99.45 78,100.2 79.25,100.2 81.05,102 STEPSTICK1.STEP
X_STOP  (via drill 0.5, 0.6)  (1 unrouted)
  Top 0.3: J7A.1 96.51,119.21 v96.5,119.2 | 65,68.7 66.25,67.45 96,67.45 v96.75,66.7
  Top 1: 96.5,124.5 96.51,122.96 J7A.1
  Top 1.27: J7.1 96.51,126.07 96.51,122.96
  Bottom 0.3: v96.5,119.2 96.5,101.7 97.5,100.7 97.5,96.7 97.75,96.45 97.75,84.45 96.25,82.95 96.25,67.2 v96.75,66.7
XTAL1  (4 unrouted)
XTAL2  (4 unrouted)
Y1A
  Top 1: J5.2 26.35,29.73 J5A.2
  Bottom 1.5: STEPSTICK2.1A 25,29.45 24.39,28.84 J5.2
Y1B
  Top 0.3: 23.05,31.03 J5.1
  Top 1: J5.1 25.55,31.53 J5A.1 | 23.05,31.03 22.45,32.23
  Bottom 0.3: 23.03,31.07 23.03,31.05 J5.1 23.01,31.07 23.01,31.11
  Bottom 1.5: STEPSTICK2.1B J5.1
Y2A
  Top 1: J5.3 27.55,28.13 J5A.3
  Bottom 1.5: STEPSTICK2.2A 26.5,27.45 25.69,26.64 J5.3
Y2B
  Top 0.3: 26.85,24.43 J5.4
  Top 1: J5.4 28.65,26.43 J5A.4 | 26.85,24.43 27.65,22.93
  Bottom 1.5: STEPSTICK2.2B 28,25.45 26.99,24.45 J5.4
Y_DIR
  Top 0.3: STEPSTICK2.DIR 39.99,58.72 45.68,53.02
Y_MIN_PIN  (1 unrouted)
  Top 0.3: 66.25,72.45 61.85,72.45 R26.1 | 60.58,71.22 R26.1 | 53.61,73.34 55.75,71.2 R26.1
Y_MS1
  Top 0.3: J19.1 STEPSTICK2.MS1 R6.2
Y_MS2
  Top 0.3: J19.3 STEPSTICK2.MS2
Y_MS3
  Top 0.3: STEPSTICK2.MS3 J19.5
Y_STEP
  Top 0.3: 46.72,50.48 40.69,56.52 STEPSTICK2.STEP
Y_STOP  (via drill 0.5, 0.6)
  Top 0.3: v23.5,49.7 23.5,46.2 22.75,45.45 J8A.1 | v29,57.2 32,57.2 v35.5,60.7 | R26.2 62.25,71.2 61,69.95 55.75,69.95 53.75,71.95 47.5,71.95 44,75.45 36.75,75.45 v35.5,74.2
  Top 0.406: J8.1 16.48,42.55
  Top 1: J8.1 18.75,43.13 J8A.1
  Bottom 0.3: v29,57.2 25.75,57.2 23.5,54.95 v23.5,49.7 | v35.5,74.2 v35.5,60.7
Z1A
  Top 1: J6A.2 129.65,40.63 J6.2
  Bottom 1.5: STEPSTICK3.1A J6.2
Z1B
  Top 0.3: J6.1 130.35,36.83
  Top 1: J6A.1 128.55,38.83 J6.1 | 130.35,36.83 129.65,35.43
  Bottom 1.5: STEPSTICK3.1B J6.1
Z2A
  Top 1: J6A.3 130.65,42.33 J6.3
  Bottom 1.5: STEPSTICK3.2A J6.3
Z2B
  Top 0.3: 134.15,43.43 J6.4
  Top 1: J6A.4 131.55,44.13 J6.4 | 134.15,43.43 134.95,44.83
  Bottom 1.5: STEPSTICK3.2B J6.4
Z_DIR
  Top 0.3: STEPSTICK3.DIR 101.62,43.32 100.75,42.45 100.75,37.26 99.75,36.26
Z_MIN_PIN  (1 unrouted)
  Top 0.3: 60.54,73.76 R27.1 | 53.57,75.88 55.75,73.7 R27.1 | R27.1 60.75,73.7 62,74.95 66.25,74.95
Z_MS1
  Top 0.3: J20.1 STEPSTICK3.MS1 110.78,57.48 R7.2
Z_MS2
  Top 0.3: J20.3 STEPSTICK3.MS2
Z_MS3
  Top 0.3: J20.5 STEPSTICK3.MS3
Z_STEP
  Bottom 0.3: STEPSTICK3.STEP 101.57,45.52 100.75,44.7 100.75,34.45 100,33.7 99.02,33.7
Z_STOP  (via drill 0.5)  (1 unrouted)
  Top 0.3: 65.75,73.7 67,72.45 v85.25,72.45 | J9A.1 114.98,31.18 111,31.18 105.52,25.7 102.5,25.7 100.75,27.45 94.5,27.45 93.5,26.45 91.25,26.45 90.25,27.45 v86.25,27.45
  Top 1: J9A.1 122.05,27.13 J9.1
  Bottom 0.3: v86.25,27.45 86.75,27.95 86.75,59.7 84.75,61.7 84.75,71.95 v85.25,72.45

### Text on the board
Top: TOP
Bottom: BOT
tPlace: PS-ON | +12V | STDBY | GND | +5V | MOT | ENDSTOP | X AXIS | MODULAR TOOL #2 | SPARE I/O | Released under / CC-BY-SA 4.0 license / (http://goo.gl/B0gjwG) / Design by Neil Jansen | MODULAR TOOL #3 | MODULAR TOOL #1 | 21_SCL | 20_SDA | RX1 | JTAG | TCK | TX1 | GND | DATA | +5V | GND | MODULAR TOOL #4 | GND | TDO | IOREF | RX2 | !RST | P/N: EMC02 Rev B | MOSI | TMS | SCLK | !RST | TX2 | +5V | 5V I/O | RX3 | MISO | TDI | TX3 | SPI/ISCP | GND | 3.3V I/O | http://delta.firepick.org | FAN1 | RXD | TXD | FAN2 | ENDSTOP | MOT | VIN | GND | GND | Z AXIS | I2C | MOT | Y AXIS | +5V | SDA | 3.3V | SCL | !RESET | ENDSTOP | GND | IOREF | +5V | RESET | GND | RX | AREF | RXD | TX | SDA | +12V | +5V | +3.3V | GND | SCL | D13 | TEST POINTS | E-STOP